# Altium project Fereydun_Board_Project.PrjPcb
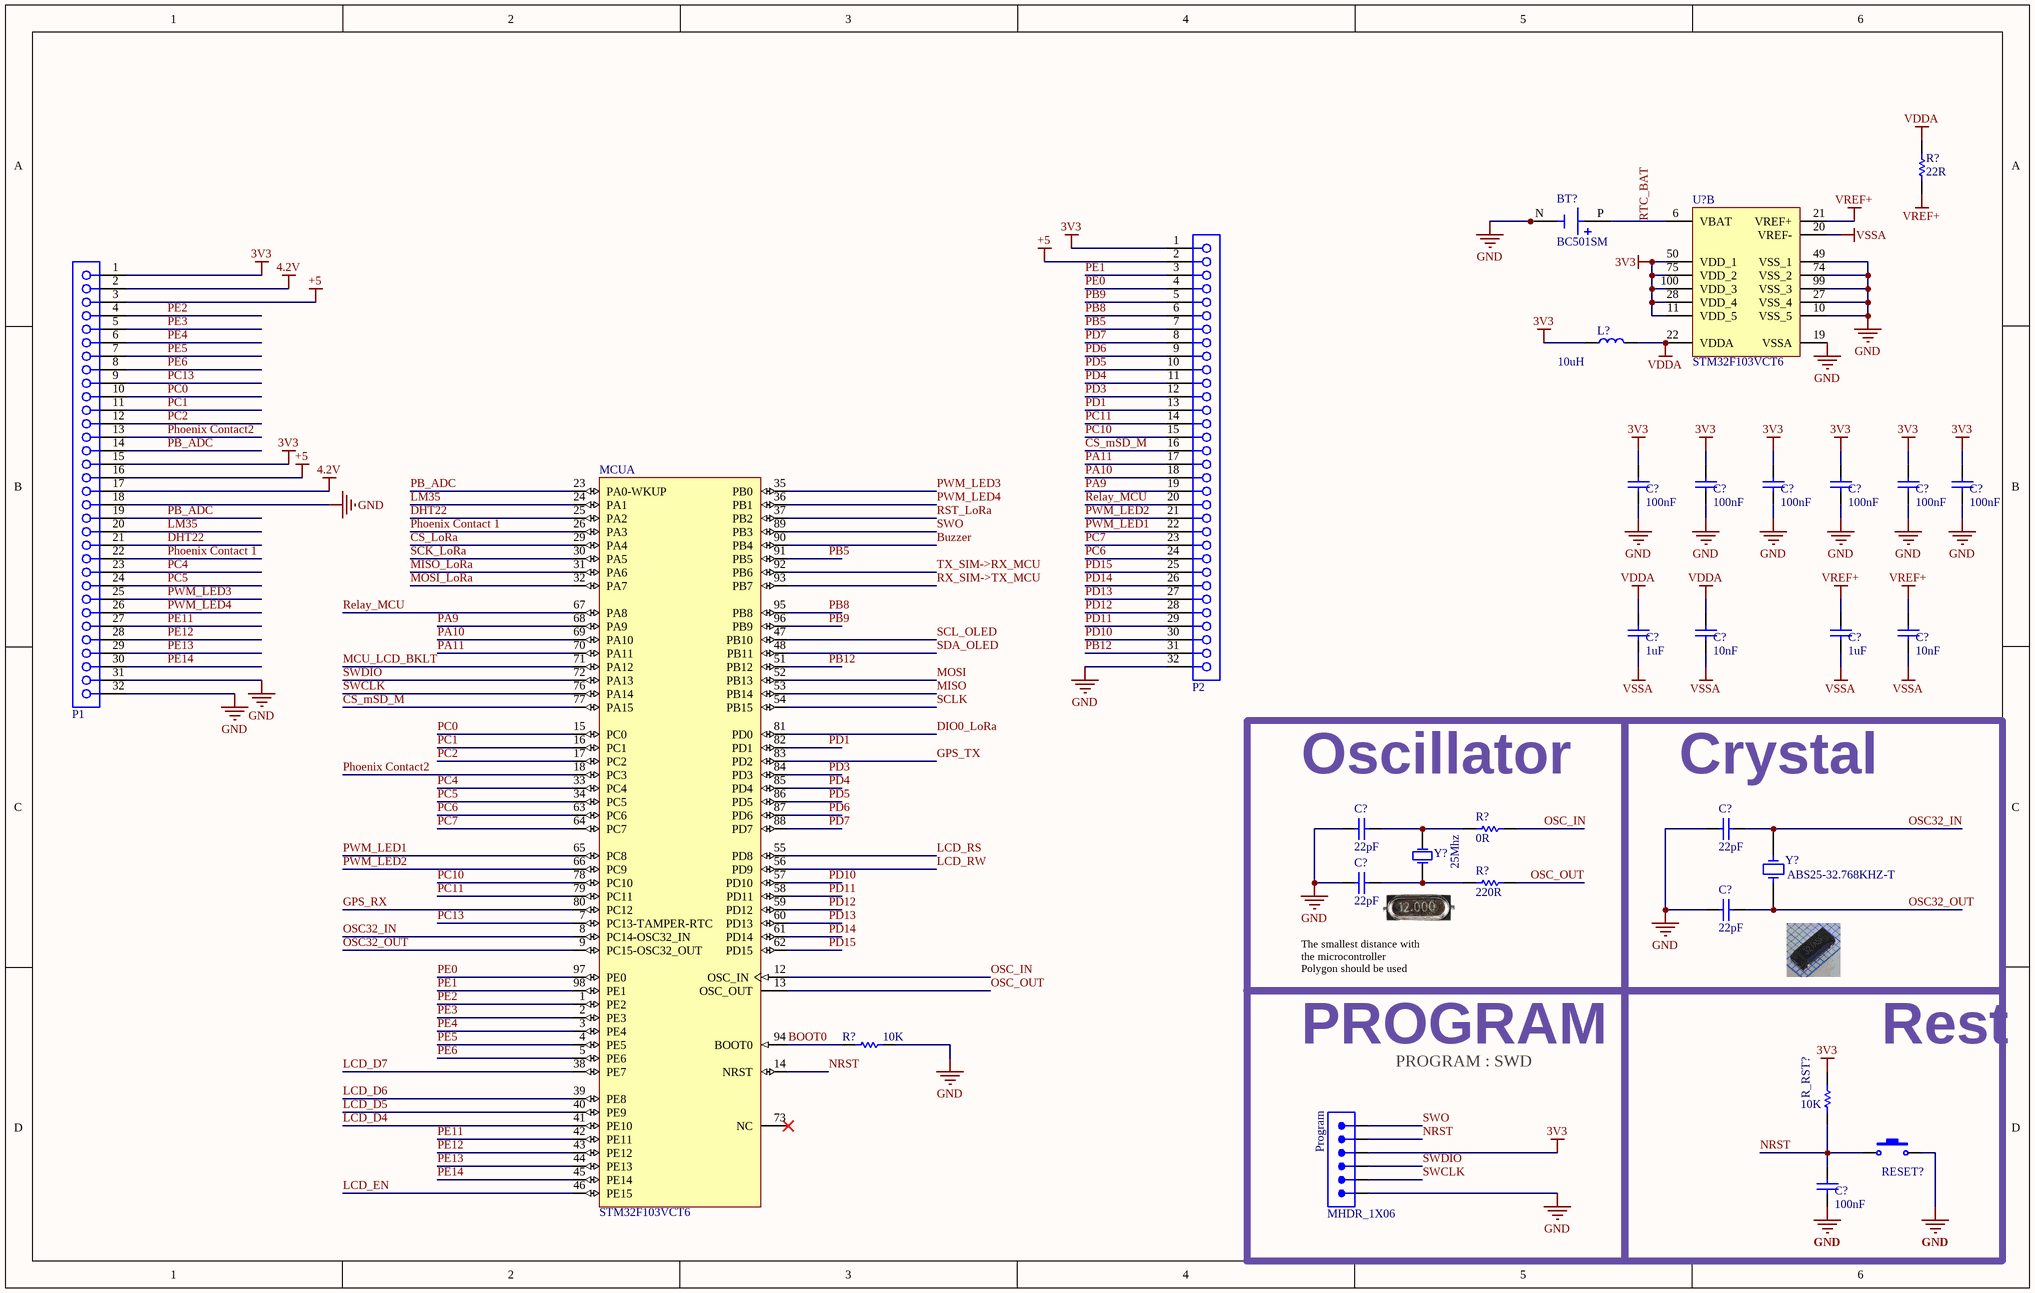
[diagram p0: MCU_F103VCT6.SchDoc]
6 sheets, 217 parts. Net scope: global (net labels, ports and power ports of the same name join across sheets).
Sheets:
  MCU_F103VCT6.SchDoc
  MCU_STM32F103C8T6.SchDoc
  POWER.SchDoc
  Communications.SchDoc
  UI.SchDoc
  ADC&Sensor&Relay.SchDoc

## Sheet MCU_F103VCT6.SchDoc
size 381 x 241 mm; SheetNumber: 1; SheetTotal: 6

### Parts
(Parts that share a designator on the sheet are numbered #1, #2 ... from top to bottom, then left to right.)
BT?  BC501SM  [BAT_BC501SM]
C?#1  100nF  [MY_CAP_SMD_0603]
C?#2  100nF  [MY_CAP_SMD_0603]
C?#3  100nF  [MY_CAP_SMD_0603]
C?#4  100nF  [MY_CAP_SMD_0603]
C?#5  100nF  [MY_CAP_SMD_0603]
C?#6  100nF  [MY_CAP_SMD_0603]
C?#7  1uF  [MY_CAP_SMD_0603]
C?#8  10nF  [MY_CAP_SMD_0603]
C?#9  1uF  [MY_CAP_SMD_0603]
C?#10  10nF  [MY_CAP_SMD_0603]
C?#11  22pF  [MY_CAP_SMD_0603]
C?#12  22pF  [MY_CAP_SMD_0603]
C?#13  22pF  [MY_CAP_SMD_0603]
C?#14  22pF  [MY_CAP_SMD_0603]
C?#15  100nF  [MY_CAP_SMD_0603]
L?#1  10uH  [L0603E]
MCU  STM32F103VCT6  [STM-LQFP100_N]  (part A of 2)
P1  61303211821  [61303211821]  (value not drawn)
P2  61303211821  [61303211821]  (value not drawn)
Program#1  MHDR_1X06  [MHDR1X06-254P]
R?#1  22R  [R0603]
R?#2  0R  [R0603]
R?#3  220R  [R0603]
R?#4  10K  [R0603]
R_RST?  10K  [RESC4817X04N]
RESET?#1  Switch PB  [Switch - Push to On]  (value not drawn)
U?#1  STM32F103VCT6  [STM-LQFP100_N]  (part B of 2)
Y?#1  25Mhz  [Crystal]
Y?#2  ABS25-32.768KHZ-T  [XTAL_ABS25-32.768KHZ-6-1-T]

### Blocks framed on the sheet
Oscillator: C?#11 C?#13 R?#2 R?#3 Y?#1
Crystal: C?#12 C?#14 Y?#2
PROGRAM: Program#1
Rest: C?#15 R_RST? RESET?#1

### Nets
3V3: C?#1.1 C?#2.1 C?#3.1 C?#4.1 C?#5.1 C?#6.1 L?#1.1 P1.1 P1.15 P2.1 Program#1.3 R_RST?.2 U?#1.11(VDD_5) U?#1.28(VDD_4) U?#1.50(VDD_1) U?#1.75(VDD_2) U?#1.100(VDD_3)
4.2V: P1.2 P1.17
+5: P1.3 P1.16 P2.2
GND: BT?.N(NEG) C?#1.2 C?#2.2 C?#3.2 C?#4.2 C?#5.2 C?#6.2 C?#11.1 C?#12.1 C?#13.1 C?#14.1 C?#15.2 P1.18 P1.31 P1.32 P2.32 Program#1.6 R?#4.1 RESET?#1.2 U?#1.10(VSS_5) U?#1.19(VSSA) U?#1.27(VSS_4) U?#1.49(VSS_1) U?#1.74(VSS_2) U?#1.99(VSS_3)
VDDA: C?#7.1 C?#8.1 L?#1.2 R?#1.1 U?#1.22(VDDA)
VREF+: C?#9.1 C?#10.1 R?#1.2 U?#1.21(VREF+)
VSSA: C?#7.2 C?#8.2 C?#9.2 C?#10.2 U?#1.20(VREF-)
BOOT0: MCU.94(BOOT0) R?#4.2
Buzzer: MCU.77(PA15) MCU.90(PB4) P2.16  [also labelled CS_mSD_M]
CS_LoRa: MCU.29(PA4)
DHT22: MCU.25(PA2) P1.21
DIO0_LoRa: MCU.81(PD0)
GPS_RX: MCU.80(PC12)
GPS_TX: MCU.83(PD2)
LCD_D4: MCU.41(PE10)
LCD_D5: MCU.40(PE9)
LCD_D6: MCU.39(PE8) MCU.47(PB10) MCU.95(PB8) P2.6  [also labelled PB8, SCL_OLED]
LCD_D7: MCU.38(PE7) MCU.48(PB11) MCU.96(PB9) P2.5  [also labelled PB9, SDA_OLED]
LCD_EN: MCU.46(PE15) MCU.53(PB14) MCU.56(PD9) MCU.91(PB5) P2.7  [also labelled LCD_RW, MISO, PB5]
LCD_RS: MCU.54(PB15) MCU.55(PD8)  [also labelled SCLK]
LM35: MCU.24(PA1) P1.20
MCU_LCD_BKLT: MCU.71(PA12)
MISO_LoRa: MCU.31(PA6)
MOSI: MCU.52(PB13)
MOSI_LoRa: MCU.32(PA7)
NRST: C?#15.1 MCU.14(NRST) Program#1.2 R_RST?.1 RESET?#1.1
OSC32_IN: C?#12.2 MCU.8(PC14-OSC32_IN) Y?#2.4
OSC32_OUT: C?#14.2 MCU.9(PC15-OSC32_OUT) Y?#2.1
OSC_IN: MCU.12(OSC_IN) R?#2.1
OSC_OUT: MCU.13(OSC_OUT) R?#3.1
PA9: MCU.68(PA9) MCU.93(PB7) P2.19  [also labelled RX_SIM->TX_MCU]
PA10: MCU.69(PA10) MCU.92(PB6) P2.18  [also labelled TX_SIM->RX_MCU]
PA11: MCU.70(PA11) P2.17
PB12: MCU.51(PB12) P2.31
PB_ADC: MCU.23(PA0-WKUP) P1.14 P1.19  [project net PA0]
PC0: MCU.15(PC0) P1.10
PC1: MCU.16(PC1) P1.11
PC2: MCU.17(PC2) P1.12
PC4: MCU.33(PC4) P1.23
PC5: MCU.34(PC5) P1.24
PC6: MCU.63(PC6) P2.24
PC7: MCU.64(PC7) P2.23
PC10: MCU.78(PC10) P2.15
PC11: MCU.79(PC11) P2.14
PC13: MCU.7(PC13-TAMPER-RTC) P1.9
PD1: MCU.82(PD1) P2.13
PD3: MCU.84(PD3) P2.12
PD4: MCU.85(PD4) P2.11
PD5: MCU.86(PD5) P2.10
PD6: MCU.87(PD6) P2.9
PD7: MCU.88(PD7) P2.8
PD10: MCU.57(PD10) P2.30
PD11: MCU.58(PD11) P2.29
PD12: MCU.59(PD12) P2.28
PD13: MCU.60(PD13) P2.27
PD14: MCU.61(PD14) P2.26
PD15: MCU.62(PD15) P2.25
PE0: MCU.97(PE0) P2.4
PE1: MCU.98(PE1) P2.3
PE2: MCU.1(PE2) P1.4
PE3: MCU.2(PE3) P1.5
PE4: MCU.3(PE4) P1.6
PE5: MCU.4(PE5) P1.7
PE6: MCU.5(PE6) P1.8
PE11: MCU.42(PE11) P1.27
PE12: MCU.43(PE12) P1.28
PE13: MCU.44(PE13) P1.29
PE14: MCU.45(PE14) P1.30
Phoenix Contact2: MCU.18(PC3) P1.13  [project net PA4]
Phoenix Contact 1: MCU.26(PA3) P1.22  [project net PA3]
PWM_LED1: MCU.65(PC8) P2.22  [project net PA6]
PWM_LED2: MCU.66(PC9) P2.21  [project net PA7]
PWM_LED3: MCU.35(PB0) MCU.67(PA8) P1.25 P2.20  [also labelled Relay_MCU]  [project net PB0]
PWM_LED4: MCU.36(PB1) P1.26
RST_LoRa: MCU.37(PB2)
RTC_BAT: BT?.P(POS) U?#1.6(VBAT)
SCK_LoRa: MCU.30(PA5)
SWCLK: MCU.76(PA14) Program#1.5
SWDIO: MCU.72(PA13) Program#1.4
SWO: MCU.89(PB3) Program#1.1
NetC?#11_2: C?#11.2 R?#2.2 Y?#1.2(OSC2)
NetC?#13_2: C?#13.2 R?#3.2 Y?#1.1(OSC1)

Not connected (* = marked no-connect by the designer): MCU 73(NC)*

### Notes on the sheet
- The smallest distance with the microcontroller
  Polygon should be used
- PROGRAM : SWD

### Library data of the parts
BT? = BC501SM: BATTERY HOLDER COIN 12MM SMD; MF: MPD; SnapEDA_Link: https://www.snapeda.com/parts/BC501SM/MPD/view-part/?ref=snap; Package: None; MP: BC501SM; Price: None; Availability: Unavailable; Check_prices: https://www.snapeda.com/parts/BC501SM/MPD/view-part/?ref=eda; Value: *
C?#1-C?#15 = CAP SMD_0603: 1.6 mm × 0.8 mm
L?#1 = Inductor SMD NC 0603: DatasheetVersion: 2021; ComponentLink1Description: Website Smart World; ComponentLink1URL: https://www.smartw.ir/; ComponentLink2Description: Telegram; ComponentLink2URL: https://t.me/altium_smartw; ComponentLink3Description: Instagram; ComponentLink3URL: https://Instagram.com/smartgw.ir
MCU U?#1 = STM32F103VCT6: ARM Cortex-M3 32-bit MCU, 256 KB Flash, 48 KB Internal RAM, 80 I/Os, 100-pin LQFP, -40 to 85 degC, Tray; ComponentLink1Description: Website Smart World; ComponentLink1URL: https://www.smartw.ir/
P1 P2 = 61303211821: WR-PHD Socket Header, THT, Vertical, pitch 2.54mm, 1 Row, 32P; Manufacturer: Wurth Elektronik; Contact Resistance: 20mOhm; Rated Current: 3A; Working Voltage: 250V; Withstanding Voltage: 500V; Manufacturer Part Number: 61303211821; Category: Board-to-Board Connectors; Match Code: WR-PHD; ComponentLink1Description: Website Link; ComponentLink1URL: https://www.we-online.com/redexpert/article/61303211821?ad; ComponentLink2Description: Datasheet Link; ComponentLink2URL: https://www.we-online.com/redexpert/spec/61303211821?ad; Mount: Through Hole; Operating Temperature Max: 105°C; Operating Temperature Min: -40°C; Packaging: Tray; Gender: Socket Header; Number of Pins: 32; Number of Rows: 1; Orientation: Vertical; Pitch: 2.54mm
Program#1 = MHDR_1X06: Male Header 1X06
R?#1-R?#4 = Resistor SMD 0603: Value: 1K; DatasheetVersion: 2021; ComponentLink1Description: Website Smart World; ComponentLink1URL: https://www.smartw.ir/; ComponentLink2Description: Telegram; ComponentLink2URL: https://t.me/altium_smartw; ComponentLink3Description: Instagram; ComponentLink3URL: https://Instagram.com/smartgw.ir
R_RST? = RES 1206 0.25W: RES 1206; Designer: Abbas Basereh; Desc.: RES SMD 1206; Data: 16-12-2016
RESET?#1 = Switch PB: Push Button Switch
Y?#1 = XTAL: Crystal Oscillator; Published: 8-Jun-2000; LatestRevisionDate: 17-Jul-2002; LatestRevisionNote: Re-released for DXP Platform.; PackageReference: R38; Publisher: Altium Limited
Y?#2 = ABS25-32.768KHZ-T: 32.768kHz Â±20ppm Crystal 12.5pF 50 kOhms 4-SOJ, 5.50mm pitch; MF: Abracon LLC; Package: 4-4 Abracon LLC; MP: ABS25-32.768KHZ; Value: *; Availability: Unavailable; Price: None; SnapEDA_Link: https://www.snapeda.com/parts/ABS25-32.768KHZ/Abracon%20LLC/view-part/478888/?ref=snap

## Sheet MCU_STM32F103C8T6.SchDoc
size 381 x 241 mm; SheetNumber: 2; SheetTotal: 6
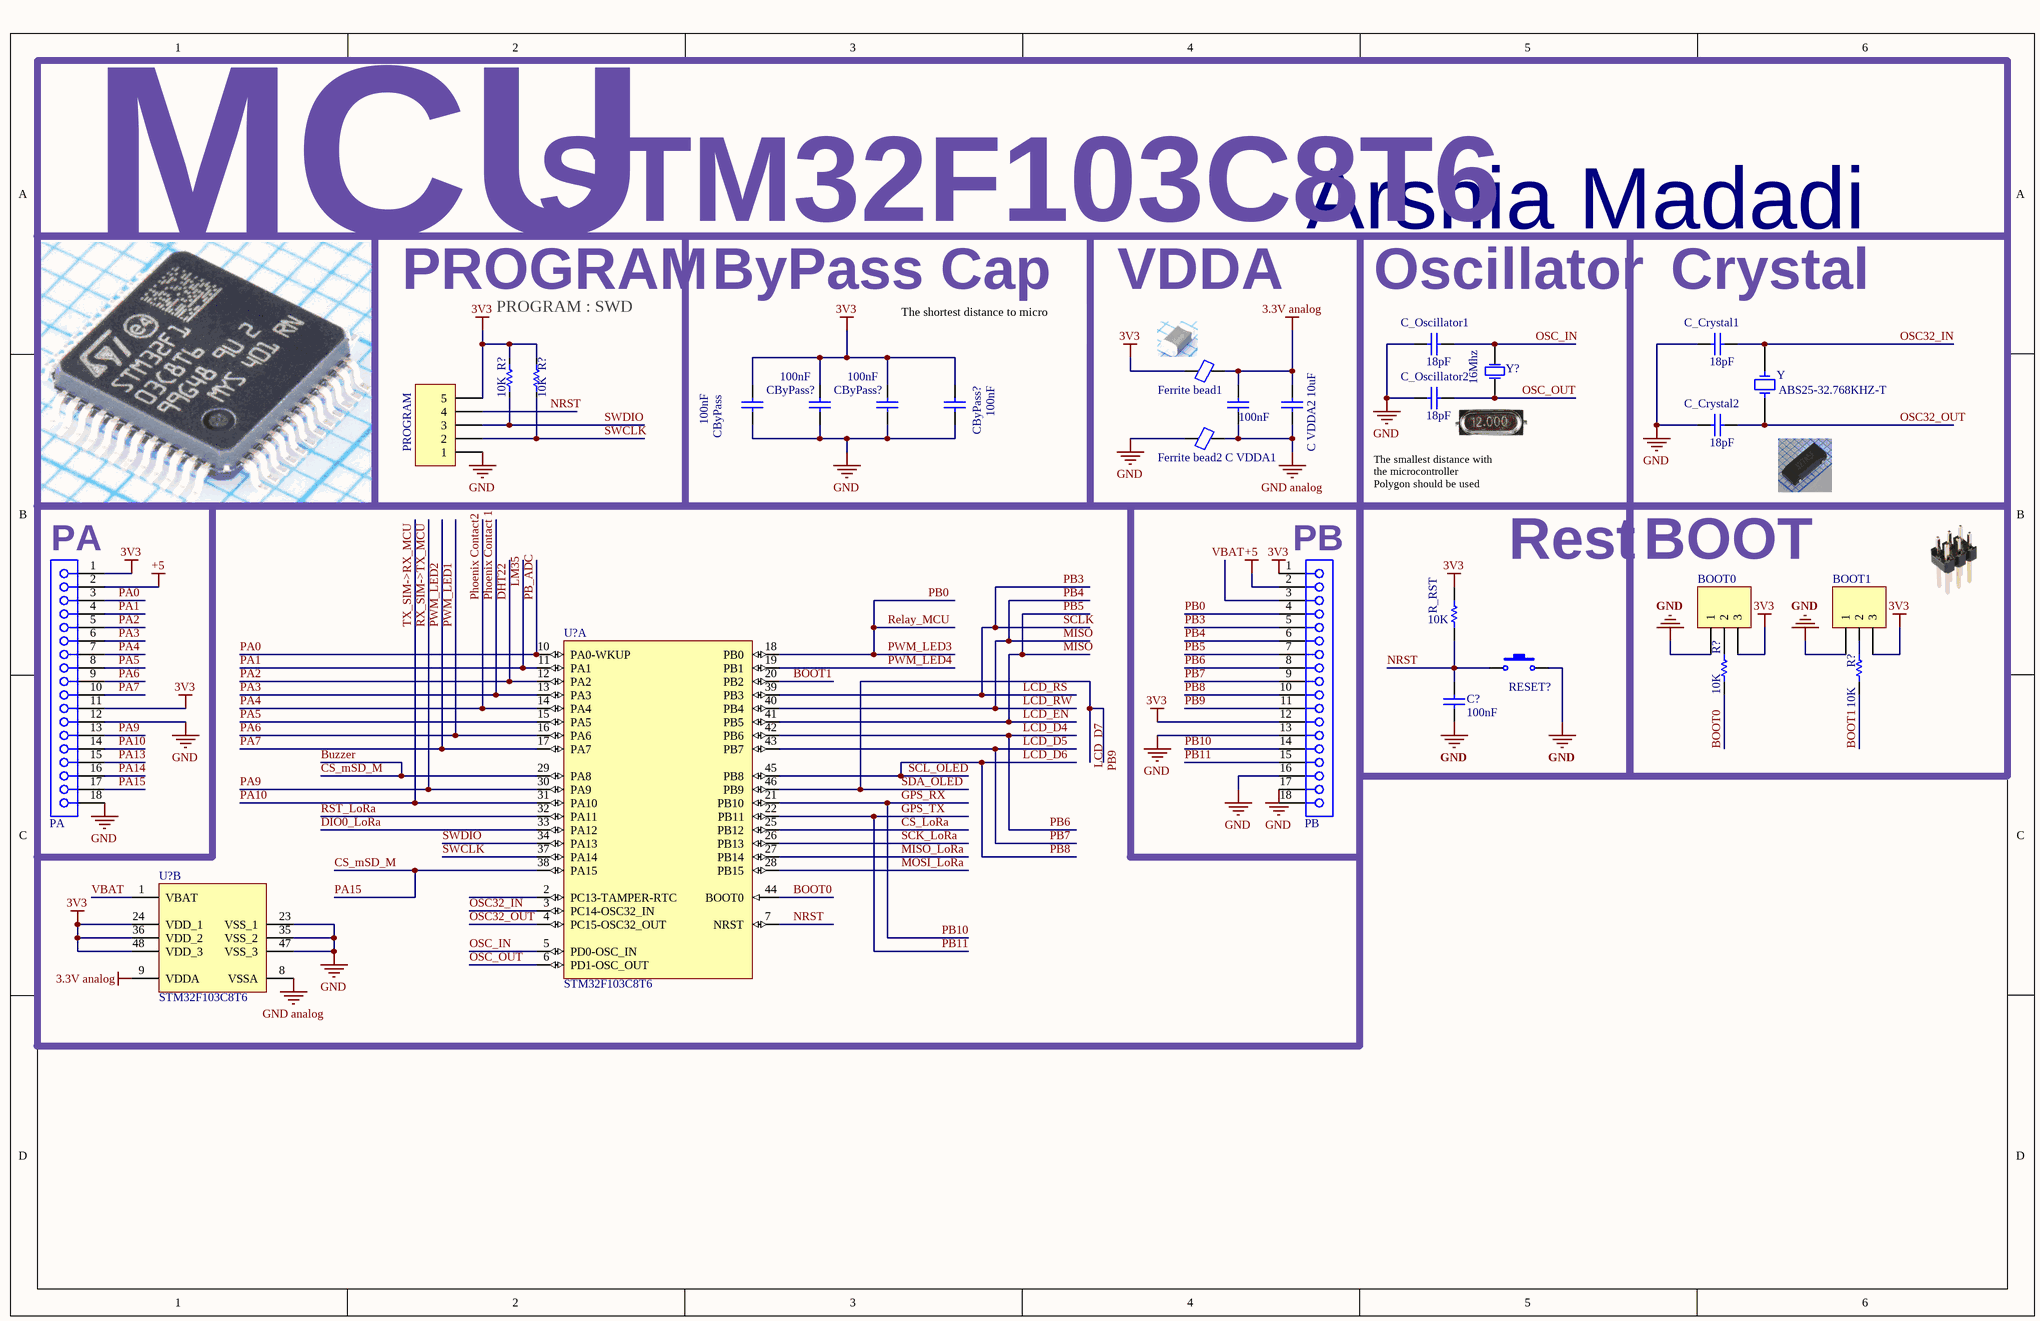
[diagram p1: MCU_STM32F103C8T6.SchDoc]

### Parts
(Parts that share a designator on the sheet are numbered #1, #2 ... from top to bottom, then left to right.)
BOOT0  Header 3  [My_1X03]  (value not drawn)
BOOT1  Header 3  [My_1X03]  (value not drawn)
C?#16  100nF  [CAPC4817X12N]
C_Crystal1  18pF  [CAPC4817X12N]
C_Crystal2  18pF  [CAPC4817X12N]
C_Oscillator1  18pF  [CAPC4817X12N]
C_Oscillator2  18pF  [CAPC4817X12N]
C_VDDA1  100nF  [CAPC4817X12N]
C_VDDA2  10uF  [CAPC4817X12N]
CByPass  100nF  [CAPC4817X12N]
CByPass?#1  100nF  [CAPC4817X12N]
CByPass?#2  100nF  [CAPC4817X12N]
CByPass?#3  100nF  [CAPC4817X12N]
Ferrite_bead1  Ferrite Bead SMD  [FB1206]  (value not drawn)
Ferrite_bead2  Ferrite Bead SMD  [FB1206]  (value not drawn)
PA  61301811821  [61301811821]  (value not drawn)
PB  61301811821  [61301811821]  (value not drawn)
PROGRAM#2  Header 5  [My_1X05]  (value not drawn)
R?#5  10K  [1206_Res]
R?#6  10K  [1206_Res]
R?#7  10K  [RESC4817X04N]
R?#8  10K  [RESC4817X04N]
R_RST  10K  [RESC4817X04N]
RESET?#2  Switch PB  [Switch - Push to On]  (value not drawn)
U?#2  STM32F103C8T6  [STM-LQFP48_M]  (part A of 2)
U?#3  STM32F103C8T6  [STM-LQFP48_M]  (part B of 2)
Y  ABS25-32.768KHZ-T  [XTAL_ABS25-32.768KHZ-6-1-T]
Y?#3  16Mhz  [Crystal]

### Blocks framed on the sheet
MCU: C_Crystal1 C_Crystal2 C_Oscillator1 C_Oscillator2 C_VDDA1 C_VDDA2 CByPass CByPass?#1-CByPass?#3 Ferrite_bead1 Ferrite_bead2 PROGRAM#2 R?#5 R?#6 Y Y?#3
PA: PA
PB: PB
Rest: C?#16 R_RST RESET?#2
BOOT: BOOT0 BOOT1 R?#7 R?#8

### Nets
3.3V analog: C_VDDA1.2 C_VDDA2.2 Ferrite_bead1.2 U?#3.9(VDDA)
3V3: BOOT0.3 BOOT1.3 CByPass.2 CByPass?#1.2 CByPass?#2.2 CByPass?#3.2 Ferrite_bead1.1 PA.1 PA.11 PB.1 PB.12 PROGRAM#2.5 R?#5.2 R?#6.2 R_RST.2 U?#3.24(VDD_1) U?#3.36(VDD_2) U?#3.48(VDD_3)
+5: PA.2 PB.2
GND: BOOT0.1 BOOT1.1 C?#16.1 C_Crystal1.1 C_Crystal2.1 C_Oscillator1.1 C_Oscillator2.1 CByPass.1 CByPass?#1.1 CByPass?#2.1 CByPass?#3.1 Ferrite_bead2.1 PA.12 PA.18 PB.13 PB.16 PB.17 PROGRAM#2.1 RESET?#2.2 U?#3.23(VSS_1) U?#3.35(VSS_2) U?#3.47(VSS_3)
GND analog: C_VDDA1.1 C_VDDA2.1 Ferrite_bead2.2 U?#3.8(VSSA)
BOOT0: R?#7.1 U?#2.44(BOOT0)
BOOT1: R?#8.1 U?#2.20(PB2)
Buzzer: PA.17 U?#2.29(PA8) U?#2.38(PA15)  [also labelled CS_mSD_M, PA15]
CS_LoRa: U?#2.25(PB12)
DHT22: PA.5 U?#2.12(PA2)  [also labelled PA2]
DIO0_LoRa: U?#2.33(PA12)
GPS_RX: PB.14 U?#2.21(PB10)  [also labelled PB10]
GPS_TX: PB.15 U?#2.22(PB11)  [also labelled PB11]
LCD_D4: PB.8 U?#2.42(PB6)  [also labelled PB6]
LCD_D5: PB.9 U?#2.43(PB7)  [also labelled PB7]
LCD_D6: PB.10 U?#2.45(PB8)  [also labelled PB8, SCL_OLED]
LCD_D7: PB.11 U?#2.46(PB9)  [also labelled PB9, SDA_OLED]
LCD_EN: PB.6 PB.7 U?#2.40(PB4) U?#2.41(PB5)  [also labelled LCD_RW, MISO, PB4, PB5]
LCD_RS: PB.5 U?#2.39(PB3)  [also labelled PB3, SCLK]
LM35: PA.4 U?#2.11(PA1)  [also labelled PA1]
MISO_LoRa: U?#2.27(PB14)
MOSI_LoRa: U?#2.28(PB15)
NRST: C?#16.2 PROGRAM#2.4 R_RST.1 RESET?#2.1 U?#2.7(NRST)
OSC32_IN: C_Crystal1.2 U?#2.3(PC14-OSC32_IN) Y.4
OSC32_OUT: C_Crystal2.2 U?#2.4(PC15-OSC32_OUT) Y.1
OSC_IN: C_Oscillator1.2 U?#2.5(PD0-OSC_IN) Y?#3.2(OSC2)
OSC_OUT: C_Oscillator2.2 U?#2.6(PD1-OSC_OUT) Y?#3.1(OSC1)
PA0: PA.3 U?#2.10(PA0-WKUP)  [also labelled PB_ADC]
PA3: PA.6 U?#2.13(PA3)  [also labelled Phoenix Contact 1]
PA4: PA.7 U?#2.14(PA4)  [also labelled Phoenix Contact2]
PA5: PA.8 U?#2.15(PA5)
PA6: PA.9 U?#2.16(PA6)  [also labelled PWM_LED1]
PA7: PA.10 U?#2.17(PA7)  [also labelled PWM_LED2]
PA9: PA.13 U?#2.30(PA9)  [also labelled RX_SIM->TX_MCU]
PA10: PA.14 U?#2.31(PA10)  [also labelled TX_SIM->RX_MCU]
PA13: PA.15
PA14: PA.16
PB0: PB.4 U?#2.18(PB0)  [also labelled PWM_LED3, Relay_MCU]
PWM_LED4: U?#2.19(PB1)
RST_LoRa: U?#2.32(PA11)
SCK_LoRa: U?#2.26(PB13)
SWCLK: PROGRAM#2.2 R?#6.1 U?#2.37(PA14)
SWDIO: PROGRAM#2.3 R?#5.1 U?#2.34(PA13)
VBAT: U?#3.1(VBAT)
NetBOOT1_2: BOOT1.2 R?#8.2

Not connected (* = marked no-connect by the designer): BOOT0 2; PB 3 18; R?#7 2; U?#2 2(PC13-TAMPER-RTC)

### Notes on the sheet
- STM32F103C8T6
- Arshia Madadi
- PROGRAM
- (near R?#5) PROGRAM : SWD
- ByPass Cap
- VDDA
- Oscillator
- (near C_Crystal1) Crystal
- The shortest distance to micro
- The smallest distance with the microcontroller
  Polygon should be used
- Labels drawn without touching a wire or pin: VBAT

### Library data of the parts
BOOT0 BOOT1 = Header 3: Header, 3-Pin; LatestRevisionDate: 17-Jul-2002; LatestRevisionNote: Re-released for DXP Platform.; Publisher: Altium Limited
C?#16 C_Crystal1 C_Crystal2 C_Oscillator1 C_Oscillator2 C_VDDA1 C_VDDA2 CByPass CByPass?#1-CByPass?#3 = CAP SMD 1206: CAP 1206; Designer: Abbas Basereh; Desc.: CAP SMD 1206; Data: 16-12-2016
Ferrite_bead1 Ferrite_bead2 = Ferrite Bead SMD Package: Designer: Ali Hafizi
PA PB = 61301811821: WR-PHD Socket Header, THT, Vertical, pitch 2.54mm, 1 Row, 18P; Manufacturer: Wurth Elektronik; Contact Resistance: 20mOhm; Rated Current: 3A; Working Voltage: 250V; Withstanding Voltage: 500V; Manufacturer Part Number: 61301811821; Category: Board-to-Board Connectors; Match Code: WR-PHD; ComponentLink1Description: Website Link; ComponentLink1URL: https://www.we-online.com/redexpert/article/61301811821?ad; ComponentLink2Description: Datasheet Link; ComponentLink2URL: https://www.we-online.com/redexpert/spec/61301811821?ad; Mount: Through Hole; Operating Temperature Max: 105°C; Operating Temperature Min: -40°C; Packaging: Tray; Gender: Socket Header; Number of Pins: 18; Number of Rows: 1; Orientation: Vertical; Pitch: 2.54mm
PROGRAM#2 = Header 5: Header, 5-Pin; LatestRevisionDate: 17-Jul-2002; LatestRevisionNote: Re-released for DXP Platform.; Publisher: Altium Limited
R?#5 R?#6 = Res: Resistor; Published: 8-Jun-2000; LatestRevisionDate: 17-Jul-2002; LatestRevisionNote: Re-released for DXP Platform.; PackageReference: AXIAL-0.3; Publisher: Altium Limited
R?#7 R?#8 R_RST = RES 1206 0.25W: as R_RST? on sheet MCU_F103VCT6; Data: 16-12-2016
RESET?#2 = Switch PB: Push Button Switch
U?#2 U?#3 = STM32F103C8T6: ARM Cortex-M3 32-bit MCU, 64 KB Flash, 20 KB Internal RAM, 37 I/Os, 48-pin LQFP, -40 to 85 degC, Tray; A/D Converter: 2x12-bit (10 Channel); FLASH Size (Prog) (kB): 64; I/Os (High Current): 37; Internal RAM Size (kB): 20; Operating Frequency(F) (Processor speed) (MHz): 72; Supply Voltage(Vcc) min (V): 2; DatasheetVersion: Rev. 16; PackageVersion: Rev. 6, 06/2013; PackageReference: LQFP48; PackageDescription: 48-Pin Low Profile Quad Flat Package, 7 x 7 mm Body, 0.5 mm Pitch; Supplier 1: Digi-Key; Supplier Part Number 1: 497-6063-ND; Supplier 2: Farnell; Supplier Part Number 2: 1447637; Supplier 3: Newark; Supplier Part Number 3: 59M2182; Supplier 4: Newark; Supplier Part Number 4: 57P1222; Supplier 5: Mouser; Supplier Part Number 5: 511-STM32F103C8T6; Core: ARM Cortex-M3; Packing: Tray; Mounting Technology: Surface Mount; PartNumber: STM32F103C8T6; ComponentLink1Description: Manufacturer URL; ComponentLink1URL: http://www.st.com/web/en/home.html; ComponentLink2Description: Datasheet; ComponentLink2URL: http://www.st.com/st-web-ui/static/active/en/resource/technical/document/datasheet/CD00161566.pdf; ComponentLink3Description: Package Specification; ComponentLink3URL: http://www.st.com/st-web-ui/static/active/en/resource/technical/document/datasheet/DM00058181.pdf
Y = ABS25-32.768KHZ-T: as Y?#2 on sheet MCU_F103VCT6; Package: 4-4 Abracon LLC; MP: ABS25-32.768KHZ; Value: *; Availability: Unavailable; Price: None; SnapEDA_Link: https://www.snapeda.com/parts/ABS25-32.768KHZ/Abracon%20LLC/view-part/478888/?ref=snap
Y?#3 = XTAL: Crystal Oscillator; Published: 8-Jun-2000; LatestRevisionDate: 17-Jul-2002; LatestRevisionNote: Re-released for DXP Platform.; PackageReference: R38; Publisher: Altium Limited

## Sheet POWER.SchDoc
size A; SheetNumber: 1; SheetTotal: 3
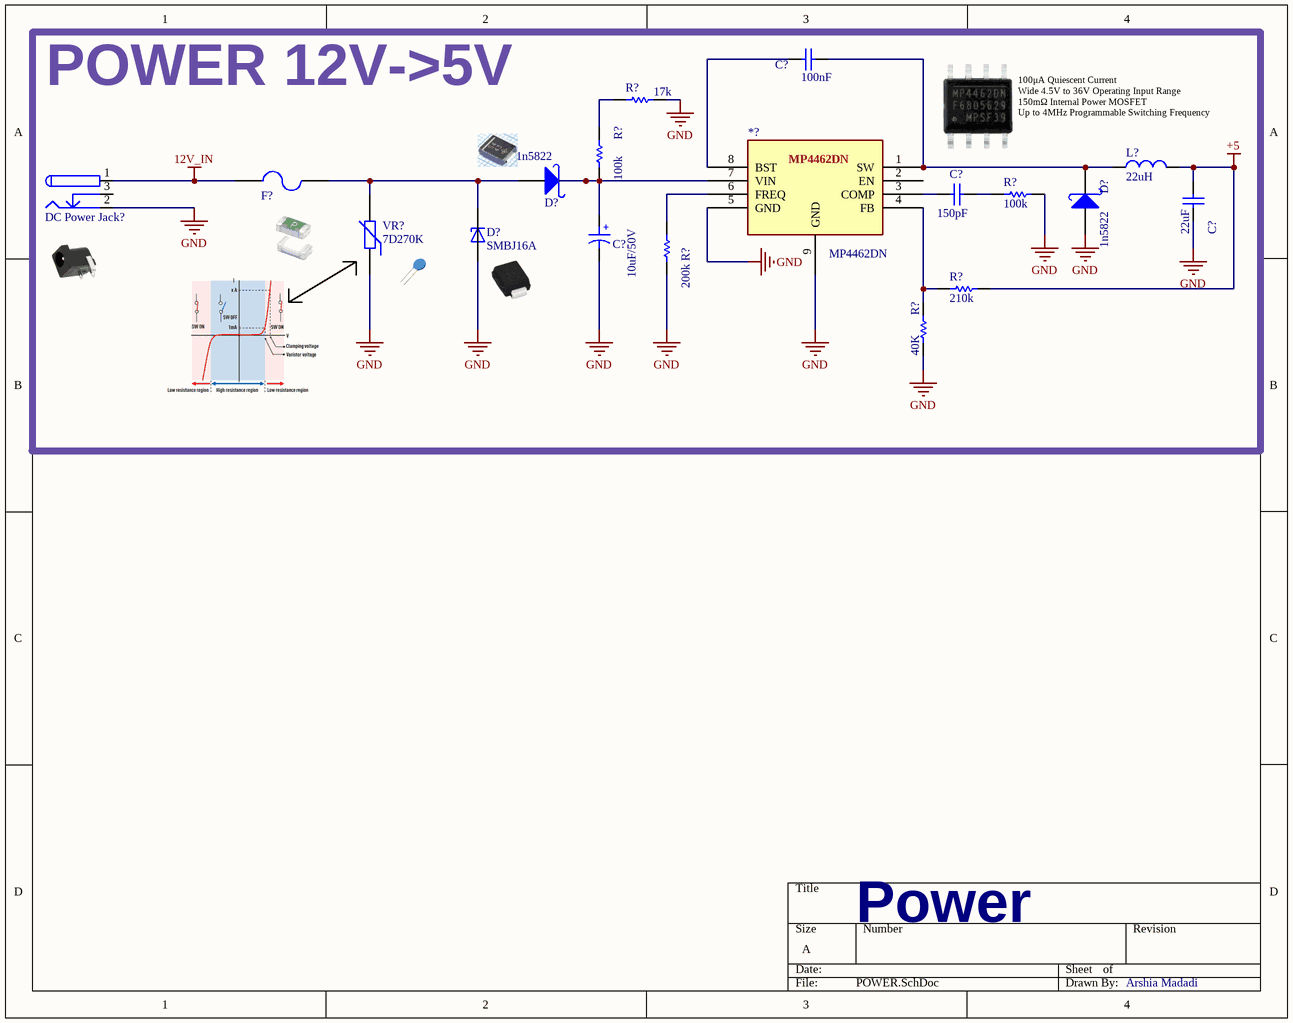
[diagram p2: POWER.SchDoc]

### Parts
(Parts that share a designator on the sheet are numbered #1, #2 ... from top to bottom, then left to right.)
*?  MP4462DN  [PCBComponent_1 - duplicate]
C?#17  100nF  [CAP1206]
C?#18  150pF  [CAP1206]
C?#19  22uF  [CAP1206]
C?#20  Part. No: 10uF/50V  [Cap electrolitic radial 10x20-5]  (hidden comment: Cap 10x21)
D?#1  1n5822  [DO-214AB(SMC)]
D?#2  1n5822  [DO-214AB(SMC)]
D?#3  SMBJ16A  [DIOM4336X265N]
DC_Power_Jack?  DC Power Jack  [DC Power Jack 1]  (value not drawn)
F?  F=3.0 A  [1206 FUSE]  (value not drawn)
L?#2  value 22uH  [0805 - big]  (hidden comment: 10uH)
R?#9  17k  [RESC4817X04N]
R?#10  100k  [RESC4817X04N]
R?#11  100k  [RESC4817X04N]
R?#12  200k  [RESC4817X04N]
R?#13  210k  [RESC4817X04N]
R?#14  40K  [RESC4817X04N]
VR?  7D270K  [07D XXX]

### Blocks framed on the sheet
POWER 12V->5V: *? C?#17-C?#20 D?#1-D?#3 DC_Power_Jack? F? L?#2 R?#9-R?#14 VR?

### Nets
12V_IN: DC_Power_Jack?.1 F?.1
+5: C?#19.1 L?#2.2 R?#13.2
GND: *?.5(GND) *?.9(GND) C?#19.2 C?#20.2 D?#2.1(A) D?#3.A DC_Power_Jack?.2 R?#9.2 R?#11.2 R?#12.1 R?#14.1 VR?.1
Net*?_1: *?.1(SW) C?#17.1 D?#2.2(K) L?#2.1
Net*?_3: *?.3(COMP) C?#18.2
Net*?_4: *?.4(FB) R?#13.1 R?#14.2
Net*?_6: *?.6(FREQ) R?#12.2
Net*?_7: *?.7(VIN) C?#20.1 D?#1.2(K) R?#10.2
Net*?_8: *?.8(BST) C?#17.2
NetC?#18_1: C?#18.1 R?#11.1
NetD?#1_1: D?#1.1(A) D?#3.C F?.2 VR?.2
NetR?#9_1: R?#9.1 R?#10.1

Not connected (* = marked no-connect by the designer): *? 2(EN); DC_Power_Jack? 3

### Notes on the sheet
- (near L?#2) 100μA Quiescent Current
  Wide 4.5V to 36V Operating Input Range
  150mΩ Internal Power MOSFET
  Up to 4MHz Programmable Switching Frequency
- Power
- Arshia Madadi
- (in symbol Cap electrolitic radial 10x21) +

### Library data of the parts
C?#17 = CAP SMD PACKAGE: TOTAL CAPACITOR SMD PACK; Designer: Abbas Basereh; Desc.: CAP SMD TOTAL PACKAGES; Data: 2017-3-10; VALUE: 100nF
C?#18 C?#19 = CAP SMD PACKAGE: TOTAL CAPACITOR SMD PACK; Designer: Abbas Basereh; Desc.: CAP SMD TOTAL PACKAGES; VALUE: 100nF; Data: 2017-3-10
C?#20 = Cap electrolitic radial 10x21: Cap electrolitic radial; Designer: Abbas Basereh; Data: 16-12-2016
D?#1 D?#2 = 1N5822 SMD: Schottky Rectifiers; Part. No: SS34; Manufacturer: ON Semiconductor/Fairchild; Designer: Abbas Basereh; Link: https://www.aliexpress.com/item/Free-shipping-100pcs-1n5822-sma-smd-do-214ac-Schottky-diode-ss34/32337482329.html?spm=2114.01010208.3.1.zLZDsP&ws_ab_test=searchweb0_0,searchweb201602_4_10065_10068_10084_10083_10080_10082_10081_10060_10061_10062_10056_10055_10054_10059_10099_10078_10079_427_10073_10103_10102_10096_10052_10050_10051,searchweb201603_4&btsid=6e50dc92-ac69-45bc-a19e-209af19ce602; Link: http://www.tme.eu/en/details/ss34/smd-schottky-diodes/vishay/ss34-e357t/; Link: http://www.digikey.com/product-detail/en/on-semiconductor-fairchild/SS34/SS34FSCT-ND/2094459; Data: 16-12-2016
D?#3 = SMBJ16A: 600W, 18.8V, 5%, Unidirectional, TVS; MF: Taiwan Semiconductor; MP: SMBJ16A; SnapEDA_Link: https://www.snapeda.com/parts/SMBJ16A/Taiwan+Semiconductor/view-part/?ref=snap; Check_prices: https://www.snapeda.com/parts/SMBJ16A/Taiwan+Semiconductor/view-part/?ref=eda; Price: None; Availability: In Stock; Purchase-URL: https://pricing.snapeda.com/search/part/SMBJ16A/?ref=eda; Package: SMD-2-2 Avago; Value: *
DC_Power_Jack? = DC Power Jack: DC Power Jack. Center Pin 2.5mm. Diameter: 5.7mm; Designer: Ali Hafizi; Company: Personal; Project Name: Laser; Adding Date: 10/21/2009
F? = Fuse SMD1206: SMD Fuses 1206; Designer: Abbas Basereh; Desc.: SMD Fuses 1206; Data: 16-12-2016
L?#2 = Inductor: Code_IEC: 1005; Published: 8-Jun-2000; LatestRevisionDate: 17-Jul-2002; LatestRevisionNote: Re-released for DXP Platform.; PackageReference: 0402-A; Publisher: Altium Limited; Code_JEITA: 0402
R?#9-R?#14 = RES 1206 0.25W: as R_RST? on sheet MCU_F103VCT6; Data: 16-12-2016
VR? = VARISTOR (VDR): VARISTORS; Manufacturer: china-canada-philipina; Designer: Abbas Basereh; VALUE: xxDxxx; Models: MOV-VDR-COV; Data: 2017-1-5; Link: digikey.com; PUBLISHER: ABBAS BASEREH

## Sheet Communications.SchDoc
size 381 x 241 mm; SheetNumber: 4; SheetTotal: 6
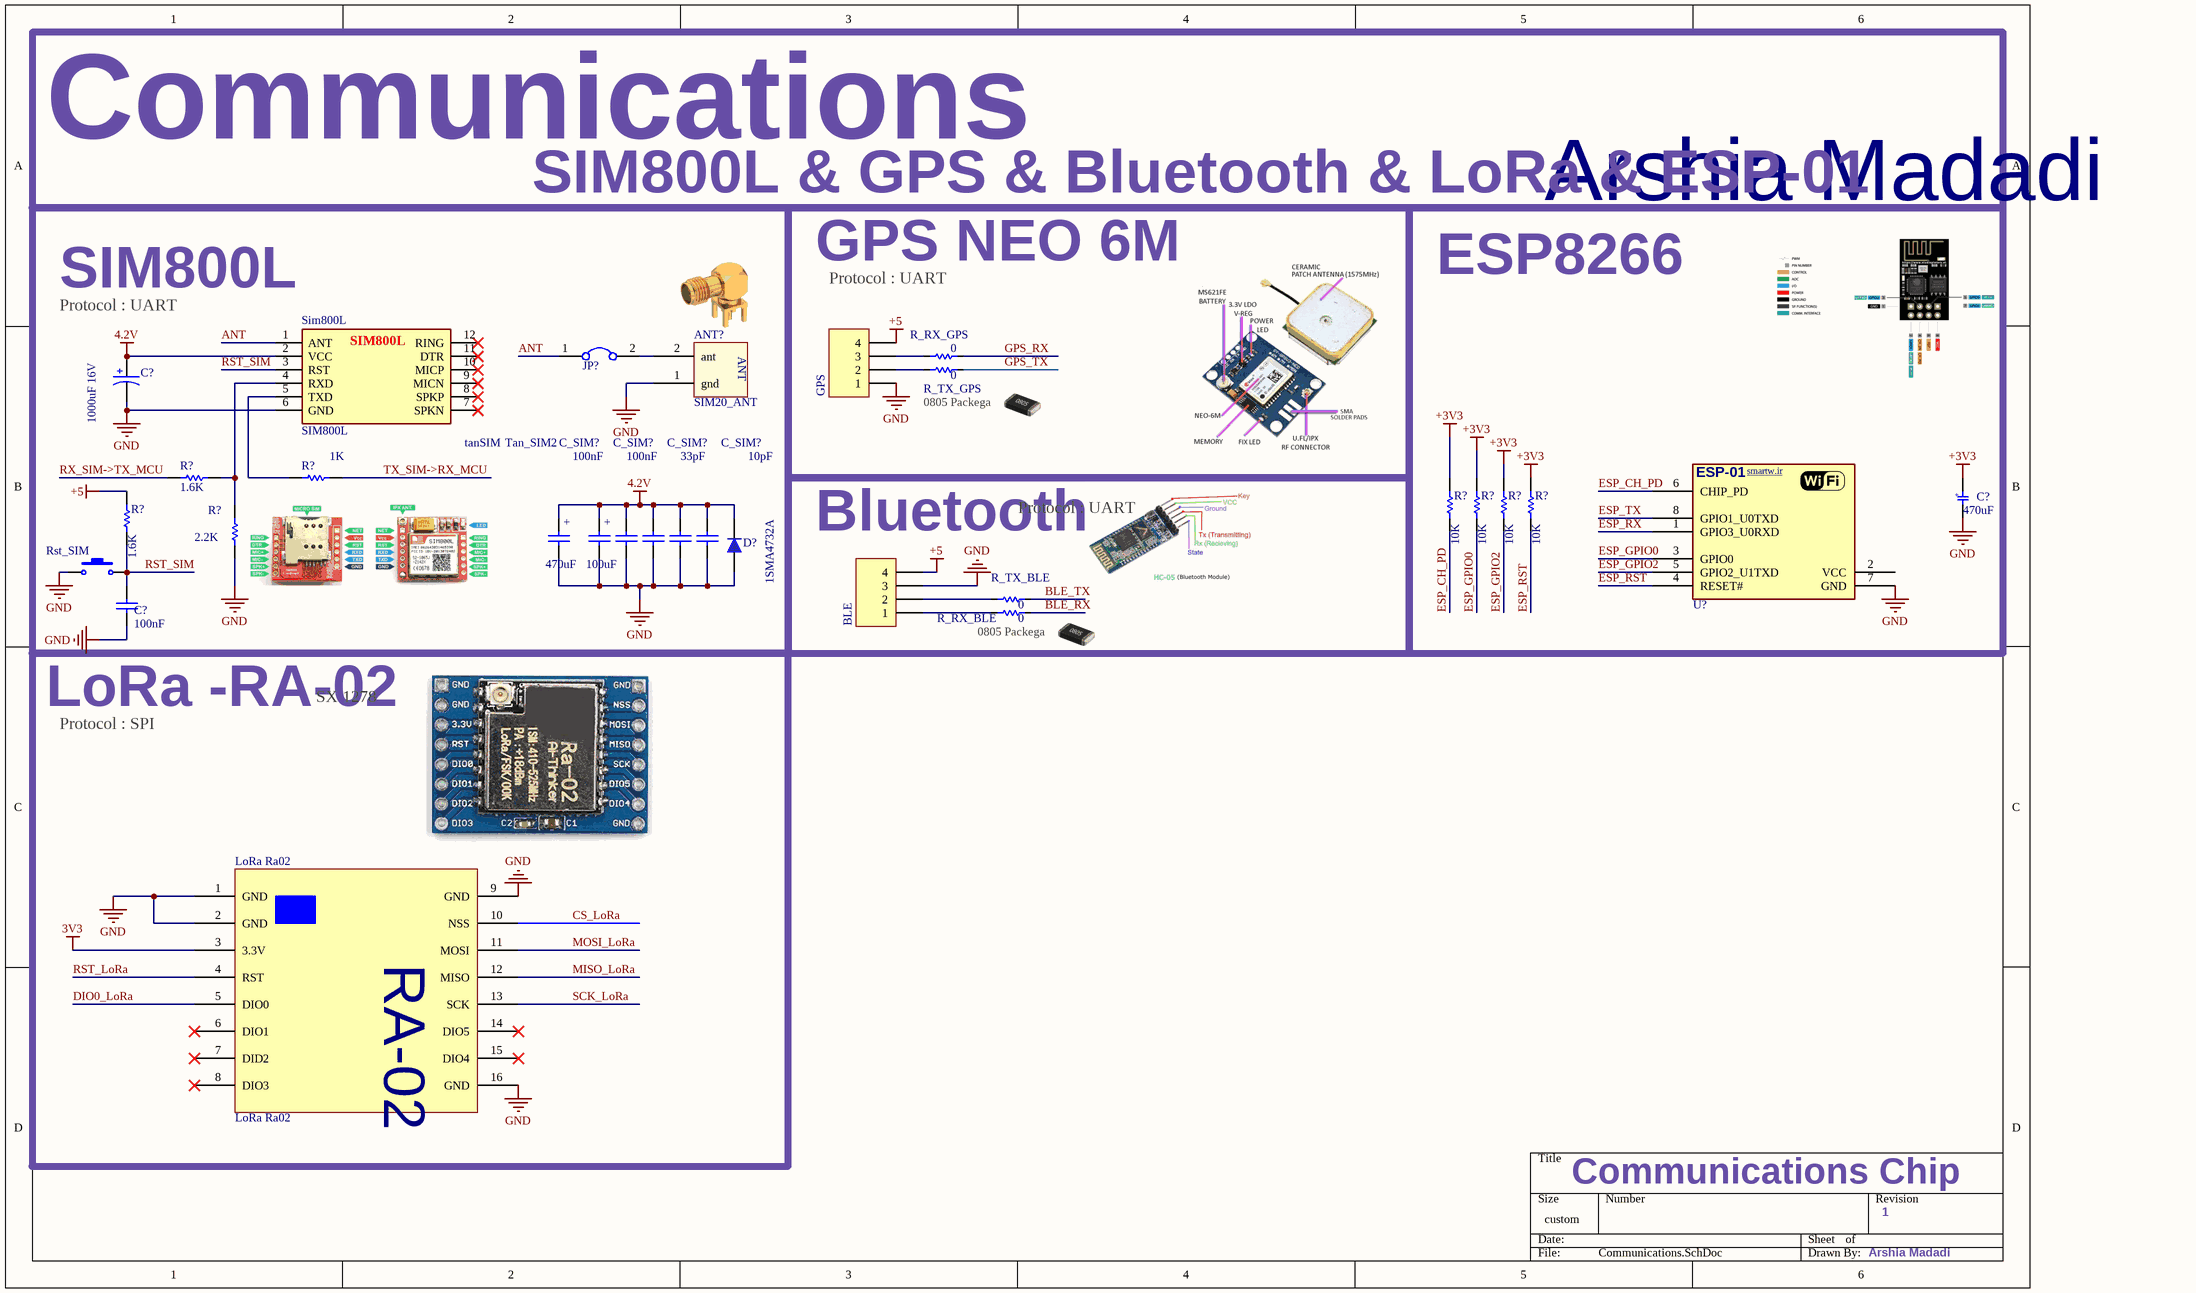
[diagram p3: Communications.SchDoc]

### Parts
(Parts that share a designator on the sheet are numbered #1, #2 ... from top to bottom, then left to right.)
100uF  Tan_SIM2  [MY_CAP_SMD-C]
470uF  tanSIM  [MY_CAP_SMD-C]
ANT?  SIM20_ANT  [MY_SIM20_ANT]
BLE  Header 4  [My_1X04]  (value not drawn)
C?#21  1000uF 16V  [SMD_1000uf 16V]
C?#22  470uF  [C_EL_10_10]
C?#23  100nF  [MY_CAP_SMD_0603]
C_SIM?#1  100nF  [CAP1206]
C_SIM?#2  100nF  [CAP1206]
C_SIM?#3  33pF  [CAP1206]
C_SIM?#4  10pF  [CAP1206]
D?#4  1SMA4732A  [SMA DIODE 2]
GPS  Header 4  [My_1X04]  (value not drawn)
JP?  Jumper  [Jumper Small - 2.54 - GRAY]  (value not drawn)
LoRa_Ra02  LoRa Ra02  [PCBComponent_1]
R?#15  1.6K  [RESC3413X04N]
R?#16  1K  [RESC3413X04N]
R?#17  10K  [RESC3413X04N]
R?#18  10K  [RESC3413X04N]
R?#19  10K  [RESC3413X04N]
R?#20  10K  [RESC3413X04N]
R?#21  1.6K  [RESC3413X04N]
R?#22  2.2K  [RESC3413X04N]
R_RX_BLE  0  [0805]
R_RX_GPS  0  [0805]
R_TX_BLE  0  [0805]
R_TX_GPS  0  [0805]
Rst_SIM  Switch PB  [SW-PB]  (value not drawn)
Sim800L  SIM800L  [SIM800L]
U?#4  ESP8266 ESP-01  [ESP8266_ESP01]  (value not drawn)

### Blocks framed on the sheet
SIM800L & GPS & Bluetooth & LoRa & ESP-01: 100uF 470uF ANT? C?#21 C?#23 C_SIM?#1-C_SIM?#4 D?#4 JP? R?#15 R?#16 R?#21 R?#22 Rst_SIM Sim800L
GPS NEO 6M: GPS R_RX_GPS R_TX_GPS
Arshia Madadi: C?#22 R?#17-R?#20 U?#4
Bluetooth: BLE R_RX_BLE R_TX_BLE
LoRa -RA-02: LoRa_Ra02

### Nets
3V3: LoRa_Ra02.3(3.3V)
4.2V: 100uF.+ 470uF.+ C?#21.1 C_SIM?#1.1 C_SIM?#2.1 C_SIM?#3.1 C_SIM?#4.1 D?#4.2 Sim800L.2(VCC)
+3V3: C?#22.2 R?#17.2 R?#18.2 R?#19.2 R?#20.2
+5: BLE.4 GPS.4 R?#21.2
GND: 100uF.- 470uF.- ANT?.1(gnd) BLE.3 C?#21.2 C?#22.1 C?#23.2 C_SIM?#1.2 C_SIM?#2.2 C_SIM?#3.2 C_SIM?#4.2 D?#4.1 GPS.1 LoRa_Ra02.1(GND) LoRa_Ra02.2(GND) LoRa_Ra02.9(GND) LoRa_Ra02.16(GND) R?#22.2 Rst_SIM.1 Sim800L.6(GND) U?#4.7(GND)
ANT: JP?.1 Sim800L.1(ANT)
BLE_RX: R_RX_BLE.2
BLE_TX: R_TX_BLE.2
CS_LoRa: LoRa_Ra02.10(NSS)
DIO0_LoRa: LoRa_Ra02.5(DIO0)
ESP_CH_PD: R?#17.1 U?#4.6(CHIP_PD)
ESP_GPIO0: R?#18.1 U?#4.3(GPIO0)
ESP_GPIO2: R?#19.1 U?#4.5(GPIO2_U1TXD)
ESP_RST: R?#20.1 U?#4.4(RESET#)
ESP_RX: U?#4.1(GPIO3_U0RXD)
ESP_TX: U?#4.8(GPIO1_U0TXD)
GPS_RX: R_RX_GPS.2
GPS_TX: R_TX_GPS.2
MISO_LoRa: LoRa_Ra02.12(MISO)
MOSI_LoRa: LoRa_Ra02.11(MOSI)
RST_LoRa: LoRa_Ra02.4(RST)
RST_SIM: C?#23.1 R?#21.1 Rst_SIM.2 Sim800L.3(RST)
RX_SIM->TX_MCU: R?#15.2  [project net PA9]
SCK_LoRa: LoRa_Ra02.13(SCK)
TX_SIM->RX_MCU: R?#16.1  [project net PA10]
NetANT?_2: ANT?.2(ant) JP?.2
NetBLE_1: BLE.1 R_RX_BLE.1
NetBLE_2: BLE.2 R_TX_BLE.1
NetGPS_2: GPS.2 R_TX_GPS.1
NetGPS_3: GPS.3 R_RX_GPS.1
NetR?#15_1: R?#15.1 R?#22.1 Sim800L.4(RXD)
NetR?#16_2: R?#16.2 Sim800L.5(TXD)

Not connected (* = marked no-connect by the designer): LoRa_Ra02 6(DIO1)* 7(DID2)* 8(DIO3)* 14(DIO5)* 15(DIO4)*; Sim800L 7(SPKN)* 8(SPKP)* 9(MICN)* 10(MICP)* 11(DTR)* 12(RING)*; U?#4 2(VCC)

### Notes on the sheet
- Communications
- SIM800L
- Protocol : UART
- ESP8266
- 0805 Packega
- (near R_RX_BLE) 0805 Packega
- SX 1278
- Protocol : SPI
- Communications Chip
- 1
- Arshia Madadi
- (in symbol Capacitor) +
- (in symbol Capacitor Electrical SMD) +
- (in symbol Component_1) RA-02
- (in symbol ESP8266 ESP-01) smartw.ir; ESP-01

### Library data of the parts
100uF 470uF = CAP_TANTAL_C: 6X3.2MM; Value: 3300u
ANT? = SIM20_ANT: ANT
BLE GPS = Header 4: Header, 4-Pin; LatestRevisionDate: 17-Jul-2002; LatestRevisionNote: Re-released for DXP Platform.; Publisher: Altium Limited
C?#21 = Capacitor: Electrolyte Capacitor
C?#22 = Capacitor Electrical SMD: DatasheetVersion: 2021; ComponentLink1Description: Website Smart World; ComponentLink1URL: https://www.smartw.ir/; ComponentLink2Description: Telegram; ComponentLink2URL: https://t.me/altium_smartw; ComponentLink3Description: Instagram; ComponentLink3URL: https://Instagram.com/smartgw.ir
C?#23 = CAP SMD_0603: 1.6 mm × 0.8 mm
C_SIM?#1 C_SIM?#2 = CAP SMD PACKAGE: as C?#17 on sheet POWER; Data: 2017-3-10; VALUE: 100nF
C_SIM?#3 C_SIM?#4 = CAP SMD PACKAGE: as C?#18 on sheet POWER; Data: 2017-3-10
D?#4 = Diode SMD Package: Diode SMD Pakage
JP? = Jumper: Company: E.P.I.L; Defualt State: Close; Design Date: 2011/11/02
LoRa_Ra02 = Component_1
R?#15-R?#22 = RES 0805 0.125W: RES 0805; Designer: Abbas Basereh; Desc.: RES SMD 0805; Data: 16-12-2016
R_RX_BLE R_RX_GPS R_TX_BLE R_TX_GPS = Res: Resistor; Published: 8-Jun-2000; LatestRevisionDate: 17-Jul-2002; LatestRevisionNote: Re-released for DXP Platform.; PackageReference: AXIAL-0.3; Publisher: Altium Limited
Rst_SIM = Switch PB: Push Button Switch
U?#4 = ESP8266 ESP-01: ESP8266 ESP-01 WiFi Module; ComponentLink1Description: Website Smart World; ComponentLink1URL: https://www.smartw.ir/; ComponentLink2Description: Telegram; ComponentLink2URL: https://t.me/altium_smartw; ComponentLink3Description: Instagram; ComponentLink3URL: https://Instagram.com/smartgw.ir; DatasheetVersion: 2021
Sim800L = SIM800L: Publisher: 3DFootprint.ir

## Sheet UI.SchDoc
size 420 x 297 mm; SheetNumber: 5; SheetTotal: 6
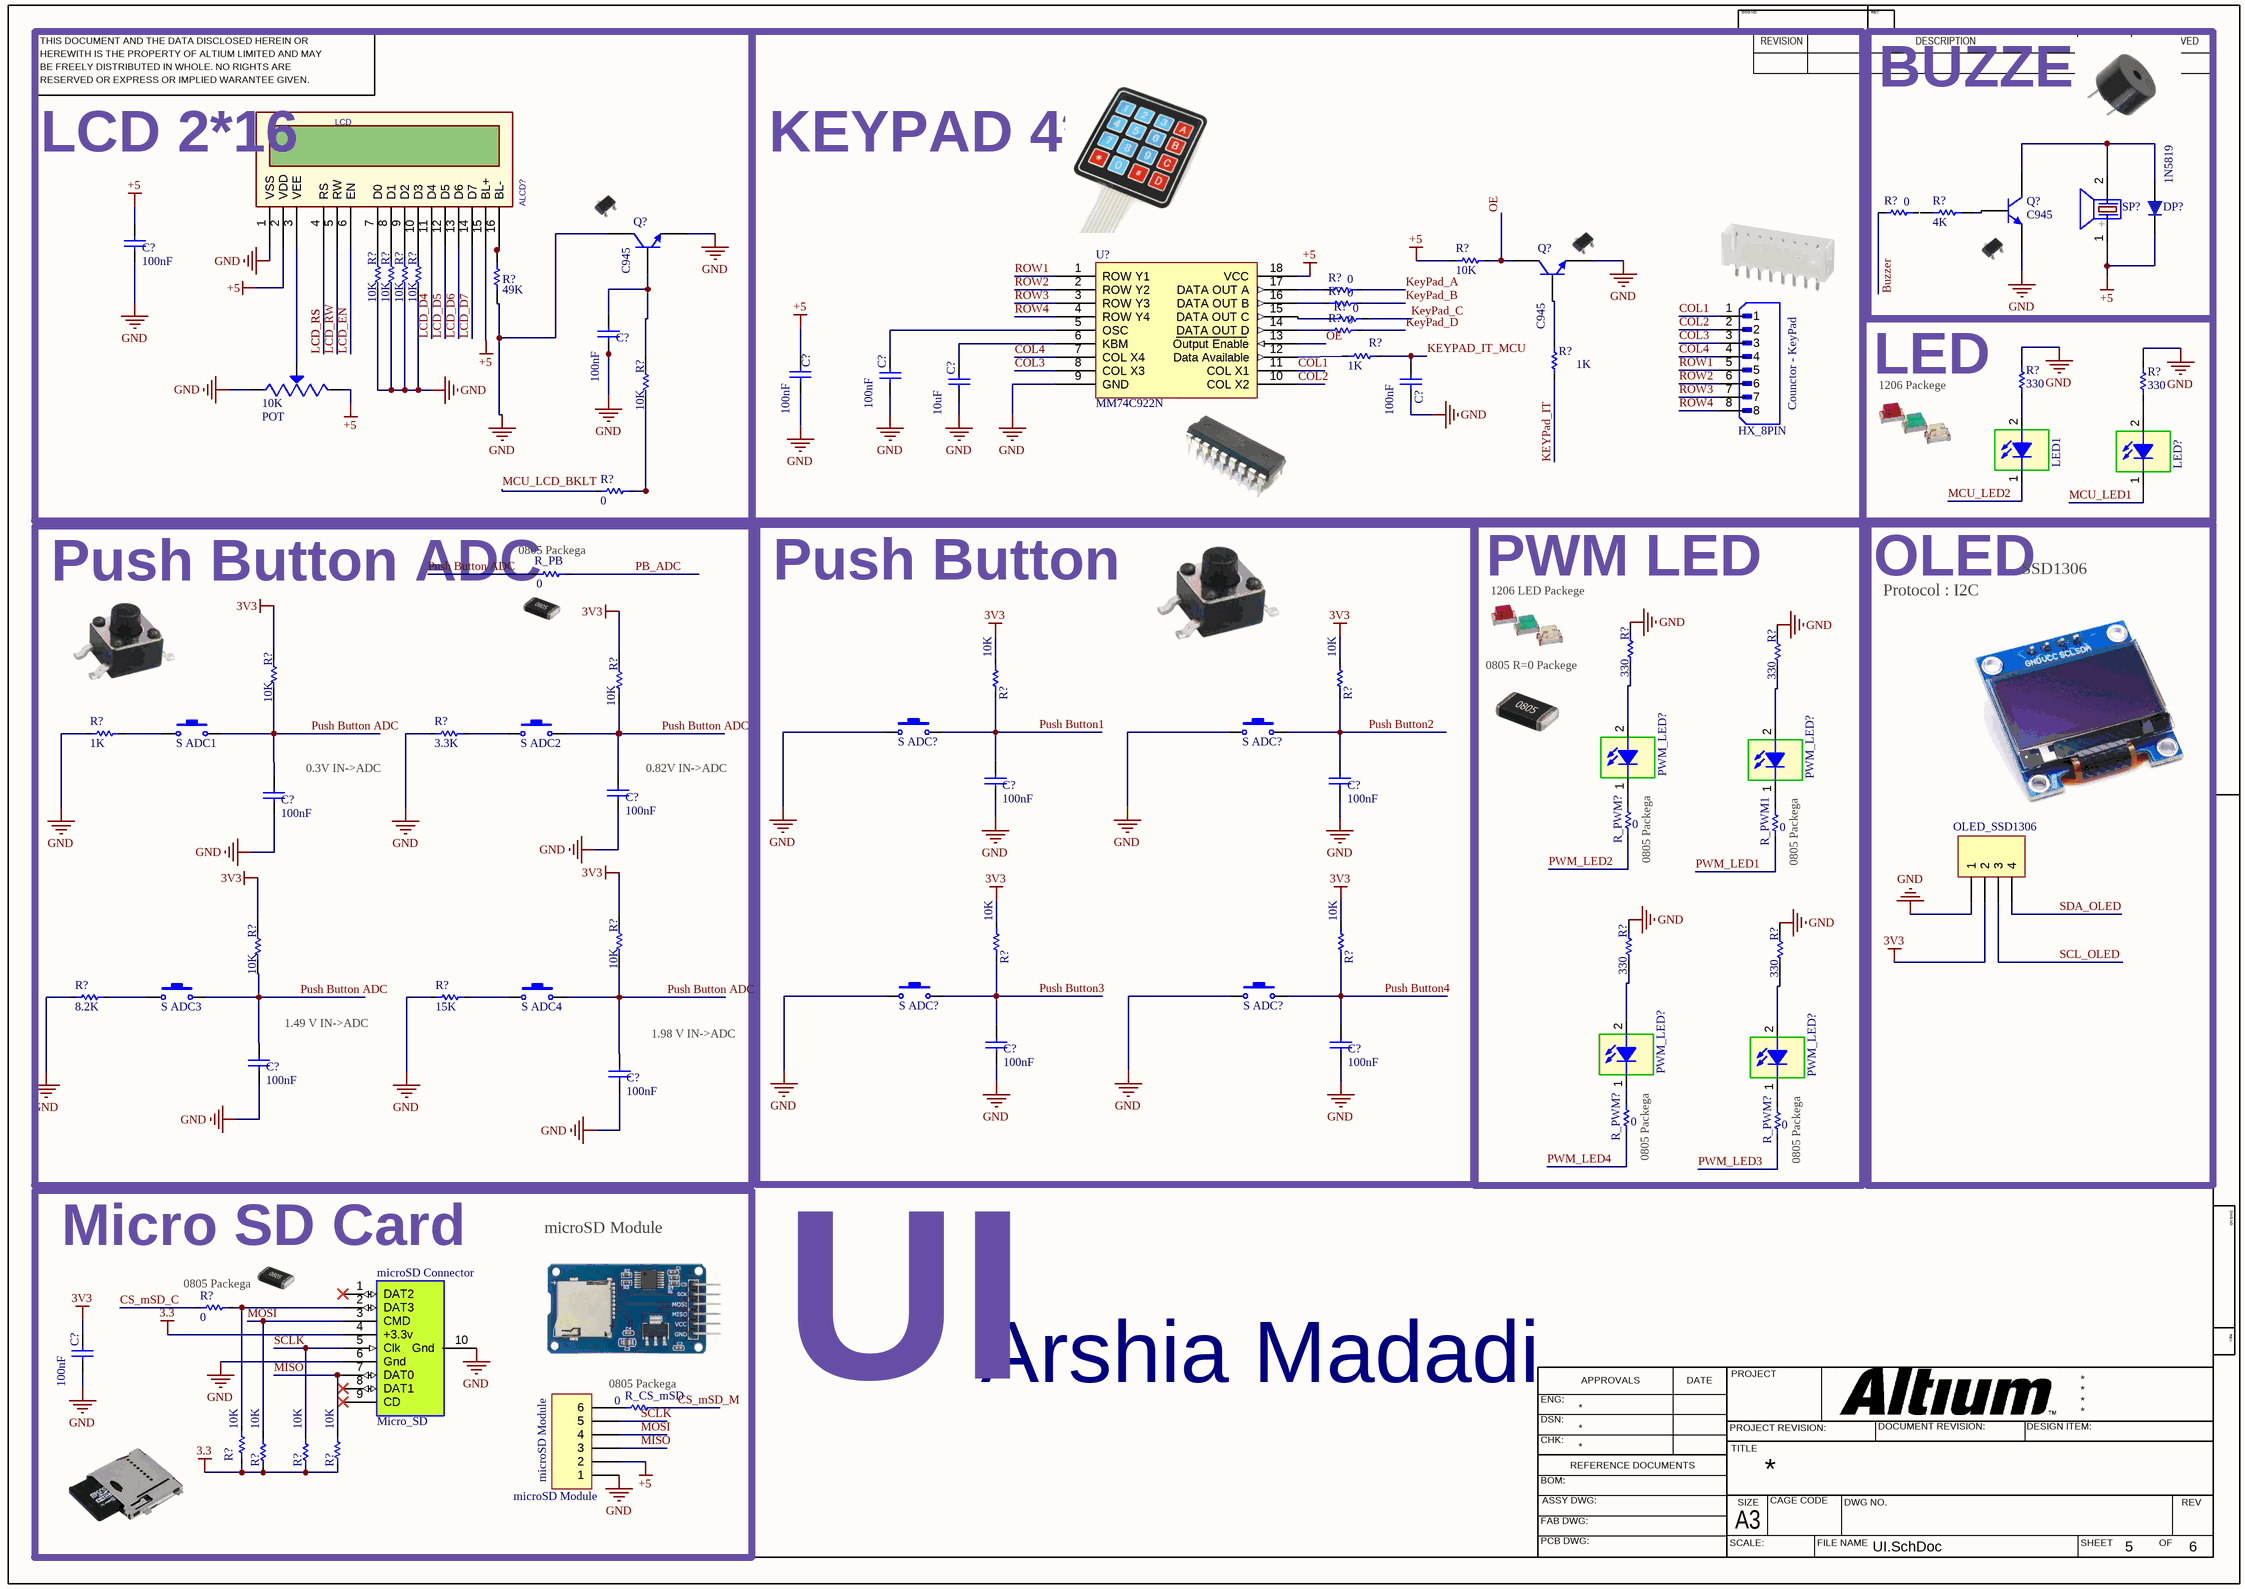
[diagram p4: UI.SchDoc]

### Parts
(Parts that share a designator on the sheet are numbered #1, #2 ... from top to bottom, then left to right.)
10K  POT  [TRIM_3296W1103LF]
ALCD?  LCD  [LCD_2X16 BLUE - 2.5mm]
C?#24  100nF  [MY_CAP_SMD_0603]
C?#25  100nF  [MY_CAP_SMD_0603]
C?#26  100nF  [CAPC3413X12N]
C?#27  100nF  [CAPC4817X12N]
C?#28  10uF  [CAPC4817X12N]
C?#29  100nF  [CAPC4817X12N]
C?#30  100nF  [MY_CAP_SMD_0603]
C?#31  100nF  [MY_CAP_SMD_0603]
C?#32  100nF  [MY_CAP_SMD_0603]
C?#33  100nF  [MY_CAP_SMD_0603]
C?#34  100nF  [MY_CAP_SMD_0603]
C?#35  100nF  [MY_CAP_SMD_0603]
C?#36  100nF  [MY_CAP_SMD_0603]
C?#37  100nF  [MY_CAP_SMD_0603]
C?#38  100nF  [CAPC4817X12N]
Counctor_-_KeyPad  HX_8PIN  [JST_B8B-XH-A(LF)(SN)]
DP?  1N5819  [430X270D]
LED1  SMD 1206 LED  [LED 1206]  (value not drawn)
LED?#1  SMD 1206 LED  [LED 1206]  (value not drawn)
microSD_Connector  Micro_SD  [MicroSd Connector]
microSD_Module  microSD Module  [HDR1X6-1]
OLED_SSD1306  Header 4  [My_1X04]  (value not drawn)
PWM_LED?#1  SMD 1206 LED  [LED 1206]  (value not drawn)
PWM_LED?#2  SMD 1206 LED  [LED 1206]  (value not drawn)
PWM_LED?#3  SMD 1206 LED  [LED 1206]  (value not drawn)
PWM_LED?#4  SMD 1206 LED  [LED 1206]  (value not drawn)
Q?#1  C945  [SOT23_M]
Q?#2  C945  [SOT23_M]
Q?#3  C945  [SOT23_M]
R?#23  4K  [RESC3413X04N]
R?#24  0  [0805]
R?#25  10K  [RESC3413X04N]
R?#26  10K  [RESC3413X04N]
R?#27  10K  [RESC3413X04N]
R?#28  10K  [RESC3413X04N]
R?#29  49K  [RESC3413X04N]
R?#30  10K  [1206_Res]
R?#31  0  [0805]
R?#32  0  [0805]
R?#33  0  [0805]
R?#34  1K  [1206_Res]
R?#35  0  [0805]
R?#36  330  [0805]
R?#37  330  [0805]
R?#38  1K  [1206_Res]
R?#39  10K  [RESC3413X04N]
R?#40  0  [0805]
R?#41  330  [RESC3413X04N]
R?#42  330  [RESC3413X04N]
R?#43  10K  [RESC3413X04N]
R?#44  10K  [RESC3413X04N]
R?#45  10K  [1206_Res]
R?#46  10K  [1206_Res]
R?#47  1K  [1206_Res]
R?#48  3.3K  [1206_Res]
R?#49  10K  [RESC3413X04N]
R?#50  10K  [RESC3413X04N]
R?#51  330  [RESC3413X04N]
R?#52  330  [RESC3413X04N]
R?#53  10K  [1206_Res]
R?#54  10K  [1206_Res]
R?#55  8.2K  [1206_Res]
R?#56  15K  [1206_Res]
R?#57  0  [0805]
R?#58  10K  [1206_Res]
R?#59  10K  [1206_Res]
R?#60  10K  [1206_Res]
R?#61  10K  [1206_Res]
R_CS_mSD  0  [0805]
R_PB  0  [0805]
R_PWM1  0  [0805]
R_PWM?#1  0  [0805]
R_PWM?#2  0  [0805]
R_PWM?#3  0  [0805]
S_ADC1  Switch PB  [SW-PB]  (value not drawn)
S_ADC2  Switch PB  [SW-PB]  (value not drawn)
S_ADC3  Switch PB  [SW-PB]  (value not drawn)
S_ADC4  Switch PB  [SW-PB]  (value not drawn)
S_ADC?#1  Switch PB  [SW-PB]  (value not drawn)
S_ADC?#2  Switch PB  [SW-PB]  (value not drawn)
S_ADC?#3  Switch PB  [SW-PB]  (value not drawn)
S_ADC?#4  Switch PB  [SW-PB]  (value not drawn)
SP?  (no value)  [BUZZER 7.62mm DC]
U?#5  MM74C922N  [DIP18]

### Blocks framed on the sheet
LCD 2*16: 10K ALCD? C?#24 C?#25 Q?#2 R?#25-R?#29 R?#39 R?#40
KEYPAD 4*4: C?#26-C?#29 Counctor_-_KeyPad Q?#3 R?#30-R?#35 R?#38 U?#5
BUZZER: DP? Q?#1 R?#23 R?#24 SP?
LED: LED1 LED?#1 R?#36 R?#37
Push Button ADC: C?#32 C?#33 C?#36 C?#37 R?#43 R?#44 R?#47-R?#50 R?#55 R?#56 R_PB S_ADC1-S_ADC4
Push Button: C?#30 C?#31 C?#34 C?#35 R?#45 R?#46 R?#53 R?#54 S_ADC?#1-S_ADC?#4
PWM LED: PWM_LED?#1-PWM_LED?#4 R?#41 R?#42 R?#51 R?#52 R_PWM1 R_PWM?#1-R_PWM?#3
OLED: OLED_SSD1306
Micro SD Card: C?#38 microSD_Connector microSD_Module R?#57-R?#61 R_CS_mSD

### Nets
3.3: microSD_Connector.4(+3.3v) R?#58.2 R?#59.2 R?#60.2 R?#61.2
3V3: C?#38.2 OLED_SSD1306.2 R?#43.1 R?#44.1 R?#45.2 R?#46.2 R?#49.1 R?#50.1 R?#53.2 R?#54.2
+5: 10K.3(CW) ALCD?.2(VDD) ALCD?.15(BL+) C?#24.1 C?#26.2 DP?.2 microSD_Module.2 R?#30.2 SP?.1(+) U?#5.18(VCC)
GND: 10K.1(CCW) ALCD?.1(VSS) C?#24.2 C?#25.2 C?#26.1 C?#27.1 C?#28.1 C?#29.1 C?#30.2 C?#31.2 C?#32.2 C?#33.2 C?#34.2 C?#35.2 C?#36.2 C?#37.2 C?#38.1 microSD_Connector.6(Gnd) microSD_Connector.10(Gnd) microSD_Module.1 OLED_SSD1306.1 Q?#1.2(E) Q?#2.2(E) Q?#2.3(C) Q?#3.2(E) R?#25.2 R?#26.2 R?#27.2 R?#28.2 R?#29.2 R?#36.1 R?#37.1 R?#41.1 R?#42.1 R?#47.1 R?#48.1 R?#51.1 R?#52.1 R?#55.1 R?#56.1 S_ADC?#1.1 S_ADC?#2.1 S_ADC?#3.1 S_ADC?#4.1 U?#5.9(GND)
Buzzer: R?#24.2 R_CS_mSD.1  [also labelled CS_mSD_M]
COL1: Counctor_-_KeyPad.1 U?#5.11(COL_X1)
COL2: Counctor_-_KeyPad.2 U?#5.10(COL_X2)
COL3: Counctor_-_KeyPad.3 U?#5.8(COL_X3)
COL4: Counctor_-_KeyPad.4 U?#5.7(COL_X4)
CS_mSD_C: R?#57.2
KeyPad_A: R?#31.1
KeyPad_B: R?#32.1
KeyPad_C: R?#33.1
KeyPad_D: R?#35.1
KEYPad_IT: R?#38.1
KEYPAD_IT_MCU: C?#29.2 R?#34.2
LCD_D4: ALCD?.11(D4)
LCD_D5: ALCD?.12(D5)
LCD_D6: ALCD?.13(D6) OLED_SSD1306.3  [also labelled SCL_OLED]
LCD_D7: ALCD?.14(D7) OLED_SSD1306.4  [also labelled SDA_OLED]
LCD_EN: ALCD?.5(RW) ALCD?.6(EN) microSD_Connector.7(DAT0) microSD_Module.3 R?#61.1  [also labelled LCD_RW, MISO]
LCD_RS: ALCD?.4(RS) microSD_Connector.5(Clk) microSD_Module.5 R?#60.1  [also labelled SCLK]
MCU_LCD_BKLT: R?#40.2
MCU_LED1: LED?#1.1
MCU_LED2: LED1.1
MOSI: microSD_Connector.3(CMD) microSD_Module.4 R?#59.1
OE: Q?#3.3(C) R?#30.1 U?#5.13(Output_Enable)
PB_ADC: R_PB.1  [project net PA0]
Push Button1: C?#30.1 R?#45.1 S_ADC?#1.2
Push Button2: C?#31.1 R?#46.1 S_ADC?#2.2
Push Button3: C?#34.1 R?#53.1 S_ADC?#3.2
Push Button4: C?#35.1 R?#54.1 S_ADC?#4.2
Push Button ADC: C?#32.1 C?#33.1 C?#36.1 C?#37.1 R?#43.2 R?#44.2 R?#49.2 R?#50.2 R_PB.2 S_ADC1.2 S_ADC2.2 S_ADC3.2 S_ADC4.2
PWM_LED1: R_PWM1.1  [project net PA6]
PWM_LED2: R_PWM?#1.1  [project net PA7]
PWM_LED3: R_PWM?#3.1  [project net PB0]
PWM_LED4: R_PWM?#2.1
ROW1: Counctor_-_KeyPad.5 U?#5.1(ROW_Y1)
ROW2: Counctor_-_KeyPad.6 U?#5.2(ROW_Y2)
ROW3: Counctor_-_KeyPad.7 U?#5.3(ROW_Y3)
ROW4: Counctor_-_KeyPad.8 U?#5.4(ROW_Y4)
Net10K_2: 10K.2(WIPER) ALCD?.3(VEE)
NetALCD?_7: ALCD?.7(D0) R?#25.1
NetALCD?_8: ALCD?.8(D1) R?#26.1
NetALCD?_9: ALCD?.9(D2) R?#27.1
NetALCD?_10: ALCD?.10(D3) R?#28.1
NetALCD?_16: ALCD?.16(BL-) R?#29.1
NetC?#25_1: C?#25.1 Q?#2.1(B) R?#39.1
NetC?#27_2: C?#27.2 U?#5.5(OSC)
NetC?#28_2: C?#28.2 U?#5.6(KBM)
NetDP?_1: DP?.1 Q?#1.3(C) SP?.2(-)
NetLED1_2: LED1.2 R?#36.2
NetLED?#1_2: LED?#1.2 R?#37.2
NetmicroSD_Connector_2: microSD_Connector.2(DAT3) R?#57.1 R?#58.1
NetmicroSD_Module_6: microSD_Module.6 R_CS_mSD.2
NetPWM_LED?#1_1: PWM_LED?#1.1 R_PWM?#1.2
NetPWM_LED?#1_2: PWM_LED?#1.2 R?#41.2
NetPWM_LED?#2_1: PWM_LED?#2.1 R_PWM1.2
NetPWM_LED?#2_2: PWM_LED?#2.2 R?#42.2
NetPWM_LED?#3_1: PWM_LED?#3.1 R_PWM?#2.2
NetPWM_LED?#3_2: PWM_LED?#3.2 R?#51.2
NetPWM_LED?#4_1: PWM_LED?#4.1 R_PWM?#3.2
NetPWM_LED?#4_2: PWM_LED?#4.2 R?#52.2
NetQ?#1_1: Q?#1.1(B) R?#23.1
NetQ?#3_1: Q?#3.1(B) R?#38.2
NetR?#31_2: R?#31.2 U?#5.17(DATA_OUT_A)
NetR?#32_2: R?#32.2 U?#5.16(DATA_OUT_B)
NetR?#33_2: R?#33.2 U?#5.15(DATA_OUT_C)
NetR?#34_1: R?#34.1 U?#5.12(Data_Available)
NetR?#35_2: R?#35.2 U?#5.14(DATA_OUT_D)
NetR?#39_2: R?#39.2 R?#40.1
NetR?#47_2: R?#47.2 S_ADC1.1
NetR?#48_2: R?#48.2 S_ADC2.1
NetR?#55_2: R?#55.2 S_ADC3.1
NetR?#56_2: R?#56.2 S_ADC4.1

Not connected (* = marked no-connect by the designer): microSD_Connector 1(DAT2)* 8(DAT1)* 9(CD)*; R?#23 2; R?#24 1

### Notes on the sheet
- 1206 Packege
- (near R_PB) 0805 Packega
- 1206 LED Packege
- Protocol : I2C
- SSD1306
- (near R?#41) 0805 R=0 Packege
- (near C?#32) 0.3V IN->ADC
- (near C?#33) 0.82V IN->ADC
- 0805 Packega
- (near C?#36) 1.49 V IN->ADC
- (near C?#37) 1.98 V IN->ADC
- microSD Module
- (near R?#57) 0805 Packega
- Arshia Madadi
- UI
- THIS DOCUMENT AND THE DATA DISCLOSED HEREIN OR
- HEREWITH IS THE PROPERTY OF ALTIUM LIMITED AND MAY
- DWG NO:
- REVISION
- REV:
- DESCRIPTION
- DATE
- APPROVED
- BE FREELY DISTRIBUTED IN WHOLE. NO RIGHTS ARE
- RESERVED OR EXPRESS OR IMPLIED WARANTEE GIVEN.
- ENG:
- APPROVALS
- PROJECT
- DSN:
- CHK:
- REFERENCE DOCUMENTS
- PROJECT REVISION:
- TITLE
- DOCUMENT REVISION:
- DESIGN ITEM:
- BOM:
- FAB DWG:
- PCB DWG:
- ASSY DWG:
- SCALE:
- A3
- SIZE
- CAGE CODE
- FILE NAME
- DWG NO.
- SHEET
- OF
- REV

### Library data of the parts
10K = 3296W1103LF: Trimmer, Potentiometer 10kohm 25turn Thd; MF: Bourns; Package: None; MP: 3296W1103LF; Check_prices: https://www.snapeda.com/parts/3296W1103LF/Bourns/view-part/2487625/?ref=eda; Availability: Unavailable; Price: None; Value: *; SnapEDA_Link: https://www.snapeda.com/parts/3296W1103LF/Bourns/view-part/2487625/?ref=snap
ALCD? = LCD: Alphanumic LCD; Designer: Abbas Basereh; Data: 16-12-2016
C?#24 C?#25 C?#30-C?#37 = CAP SMD_0603: 1.6 mm × 0.8 mm
C?#26 = CAP SMD 0805: CAP 0805; Designer: Abbas Basereh; Desc.: CAP SMD 0805; Data: 16-12-2016
C?#27-C?#29 C?#38 = CAP SMD 1206: CAP 1206; Designer: Abbas Basereh; Desc.: CAP SMD 1206; Data: 16-12-2016
Counctor_-_KeyPad = B8B-XH-A(LF)(SN): Connector Header Through Hole 8 position 0.098 (2.50mm); MF: JST Sales America Inc.; SnapEDA_Link: https://www.snapeda.com/parts/B8B-XH-A(LF)(SN)/JST+Sales+America+Inc./view-part/?ref=snap; Package: None; Value: *; MP: B8B-XH-A(LF)(SN); Check_prices: https://www.snapeda.com/parts/B8B-XH-A(LF)(SN)/JST+Sales+America+Inc./view-part/?ref=eda
DP? = 1N5819: Schottkey Rectifiers; Designer: Abbas Basereh; Data: 16-12-2016; Link: *; Part. No: *
LED1 LED?#1 PWM_LED?#1-PWM_LED?#4 = LED SMD 1206
microSD_Connector = Micro_SD: Micro sd in SD MODE 4pin
microSD_Module = Header 6: Header, 6-Pin; LatestRevisionDate: 17-Jul-2002; LatestRevisionNote: Re-released for DXP Platform.; Publisher: Altium Limited
OLED_SSD1306 = Header 4: Header, 4-Pin; LatestRevisionDate: 17-Jul-2002; LatestRevisionNote: Re-released for DXP Platform.; Publisher: Altium Limited
Q?#1-Q?#3 = C945: NPN Silicon Epitaxial Planar Transistor; Published: 2017-2-8; LatestRevisionDate: 2017; LatestRevisionNote: IPC-7351 Footprint Added.; DatasheetVersion: 2017; PackageVersion: 2017-2-8; PackageReference: SOT23; Publisher: Abbas Basereh; PackageDescription: 3-Pin SOT-23 Package 0.95 mm Pitch, 2.3 mm Lead Span; ComponentLink1Description: Manufacturer Link; ComponentLink1URL: http://www.taitroncomponents.com/; ComponentLink2Description: Datasheet; ComponentLink2URL: http://www.taitroncomponents.com/
R?#23 R?#25-R?#29 R?#39 R?#41-R?#44 R?#49-R?#52 = RES 0805 0.125W: as R?#15 on sheet Communications; Data: 16-12-2016
R?#24 R?#30-R?#38 R?#40 R?#45-R?#48 R?#53-R?#61 R_CS_mSD R_PB R_PWM1 R_PWM?#1-R_PWM?#3 = Res: Resistor; Published: 8-Jun-2000; LatestRevisionDate: 17-Jul-2002; LatestRevisionNote: Re-released for DXP Platform.; PackageReference: AXIAL-0.3; Publisher: Altium Limited
S_ADC1-S_ADC4 S_ADC?#1-S_ADC?#4 = Switch PB: Push Button Switch
SP? = PIEZO BUZZER: PIEZO BUZZER ACTIVE; Designer: Abbas Basereh; Comment_1: SPEAKER AND BEEP; Design Date: 1395/11/14; ComponentLink2Description: Reference; PackageDescription: THD; Publisher: Abbas Basereh; Mounting Technology: THD; Pin Count: 2; Status: Unreleased
U?#5 = MM74c922N_Fairchild: 16-Key Encoder

## Sheet ADC&Sensor&Relay.SchDoc
size A; SheetNumber: 6; SheetTotal: 6
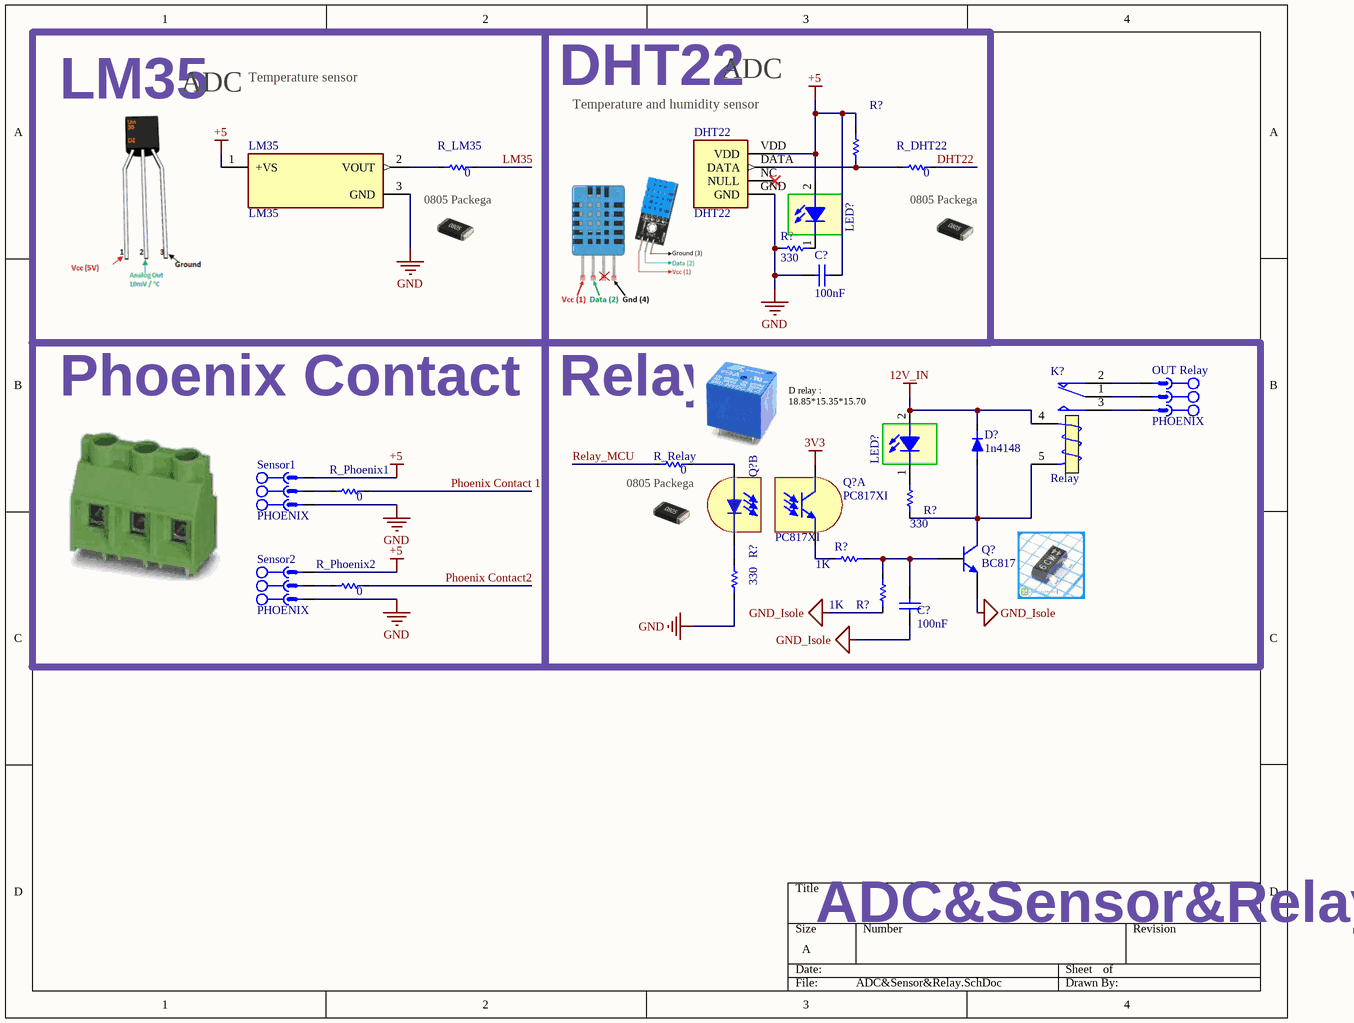
[diagram p5: ADC&Sensor&Relay.SchDoc]

### Parts
(Parts that share a designator on the sheet are numbered #1, #2 ... from top to bottom, then left to right.)
C?#39  100nF  [CAPC3413X12N]
C?#40  100nF  [MY_CAP_SMD_0603]
D?#5  1n4148  [SOD123]
DHT22  DHT22  [DHT22]
K?  Relay  [Relay 18.85x15.35x15.70]
LED?#2  SMD 1206 LED  [LED 1206]  (value not drawn)
LED?#3  SMD 1206 LED  [LED 1206]  (value not drawn)
LM35  LM35  [TO92127P521H735-3]
OUT_Relay  PHOENIX  [MSTB 2,5/3-G-5,08]
Q?#4  PC817XI  [SMT Gullwing Lead-Form]  (part B of 2)
Q?#5  PC817XI  [SMT Gullwing Lead-Form]  (part A of 2)
Q?#6  BC817  [SOT23_N]
R?#62  (no value)  [0805]
R?#63  330  [0805]
R?#64  330  [1206_Res]
R?#65  1K  [0805]
R?#66  1K  [0805]
R?#67  330  [1206_Res]
R_DHT22  0  [0805]
R_LM35  0  [0805]
R_Phoenix1  0  [0805]
R_Phoenix2  0  [0805]
R_Relay  0  [0805]
Sensor1  PHOENIX  [MSTB 2,5/3-G-5,08]
Sensor2  PHOENIX  [MSTB 2,5/3-G-5,08]

### Blocks framed on the sheet
LM35: LM35 R_LM35
DHT22: C?#39 DHT22 LED?#2 R?#62 R?#63 R_DHT22
Phoenix Contact: R_Phoenix1 R_Phoenix2 Sensor1 Sensor2
Relay: C?#40 D?#5 K? LED?#3 OUT_Relay Q?#4-Q?#6 R?#64-R?#67 R_Relay

### Nets
3V3: Q?#5.4(C)
12V_IN: D?#5.2(K) K?.4(T1) LED?#3.2
+5: C?#39.2 DHT22.VDD LED?#2.2 LM35.1(+VS) R?#62.2 Sensor1.3 Sensor2.3
GND: C?#39.1 DHT22.GND LM35.3(GND) R?#63.1 R?#67.1 Sensor1.1 Sensor2.1
GND_Isole: C?#40.2 Q?#6.2(E) R?#66.2
DHT22: R_DHT22.2
LM35: R_LM35.2
Phoenix Contact2: R_Phoenix2.2  [project net PA4]
Phoenix Contact 1: R_Phoenix1.2  [project net PA3]
Relay_MCU: R_Relay.1  [project net PB0]
NetC?#40_1: C?#40.1 Q?#6.1(B) R?#65.2 R?#66.1
NetD?#5_1: D?#5.1(A) K?.5(T2) Q?#6.3(C) R?#64.1
NetDHT22_DATA: DHT22.DATA R?#62.1 R_DHT22.1
NetK?_1: K?.1(COM) OUT_Relay.2
NetK?_2: K?.2(NC) OUT_Relay.1
NetK?_3: K?.3(NO) OUT_Relay.3
NetLED?#2_1: LED?#2.1 R?#63.2
NetLED?#3_1: LED?#3.1 R?#64.2
NetLM35_2: LM35.2(VOUT) R_LM35.1
NetQ?#4_1: Q?#4.1(A) R_Relay.2
NetQ?#4_2: Q?#4.2(K) R?#67.2
NetQ?#5_3: Q?#5.3(E) R?#65.1
NetR_Phoenix1_1: R_Phoenix1.1 Sensor1.2
NetR_Phoenix2_1: R_Phoenix2.1 Sensor2.2

Not connected (* = marked no-connect by the designer): DHT22 NC(NULL)*

### Notes on the sheet
- ADC
- Temperature sensor
- (near DHT22) Temperature and humidity sensor
- 0805 Packega
- (near R_DHT22) 0805 Packega
- (near LED?#3) D relay : 18.85*15.35*15.70
- (near R_Relay) 0805 Packega
- ADC&Sensor&Relay

### Library data of the parts
C?#39 = CAP SMD 0805: CAP 0805; Designer: Abbas Basereh; Desc.: CAP SMD 0805; Data: 16-12-2016
C?#40 = CAP SMD_0603: 1.6 mm × 0.8 mm
D?#5 = Diode
DHT22 = DHT22: Capacitive-type humidity and temperature module/sensor; MF: Aosong Electronics; SnapEDA_Link: https://www.snapeda.com/parts/DHT22/Aosong+Electronics/view-part/?ref=snap; Package: Package; Value: *; MP: DHT22; Check_prices: https://www.snapeda.com/parts/DHT22/Aosong+Electronics/view-part/?ref=eda
K? = Relay: SPDT Relay; Designer: Eng. Saeid Jorablo; Company: E.P.I.L; Design_Date: 2011/10/31
LED?#2 LED?#3 = LED SMD 1206
LM35 = LM35DZ/NOPB: Temperature Sensor Analog, Local 0Â°C ~ 100Â°C 10mV/Â°C TO-92-3; MP: LM35DZ; MF: Texas Instruments; Price: None; Availability: In Stock; Package: E-PKG AXIAL-LEADED-2 ON Semiconductor; Value: *; SnapEDA_Link: https://www.snapeda.com/parts/LM35DZ/Texas+Instruments/view-part/?ref=snap; Purchase-URL: https://pricing.snapeda.com/search/part/LM35DZ/?ref=eda; Check_prices: https://www.snapeda.com/parts/LM35DZ/Texas+Instruments/view-part/?ref=eda
OUT_Relay Sensor1 Sensor2 = CON_Phoenix_MSTB_03: 3 Pitch: 5.08 mm Color: green Contact surface: Tin Assembly; Manufacturer: PHOENIX CONTACT; Connector type: PCB Terminal Block; designer: ABBAS BASEREH; Max Current: 12 A; Positions: 3; Voltage: 320 V; Category: Connector; ComponentLink1Description: Header, Nominal current: 12 A Rated voltage (III/2): 320 V Number of positions: 3 Pitch: 5.08 mm Color: green Contact surface: Tin Assembly: Soldering  DESIGNER:ABBAS BASEREH; ComponentLink2Description: Reference; Mounting Technology: Through-Hole; Pin Count: 3; Revision 1: 2017-3-1; Status: Unreleased; PART.NO: PHOENIX
Q?#4 Q?#5 = PC817XI: DIP 4pin General Purpose  Photocoupler; Published: 2017-2-27; DatasheetVersion: 2017-2-27; PackageVersion: 2017-2-27; PackageReference: SMT Gullwing Lead-Form; Publisher: Abbas Basereh; PackageDescription: SOP, 4-Leads, Body 4/65x6/75mm, Pitch 2/54mm, IPC Medium Density designer:abbas basereh; ComponentLink1Description: Manufacturer Link; ComponentLink1URL: http://www.roboeq.ir/files/id/233/name/PC817.pdf/; ComponentLink2Description: DIP 4pin General Purpose
Q?#6 = BC817: 45 V, 500 mA NPN general-purpose transistors; Published: 2017-2-8; LatestRevisionDate: 2017; LatestRevisionNote: IPC-7351 Footprint Added.; DatasheetVersion: 2017; PackageVersion: 2017-2-8; PackageReference: SOT23; Publisher: Abbas Basereh; PackageDescription: 3-Pin SOT-23 Package 0.95 mm Pitch, 2.3 mm Lead Span; ComponentLink1Description: Manufacturer Link; ComponentLink1URL: http://www.nxp.com/; ComponentLink2Description: Datasheet; ComponentLink2URL: http://www.nxp.com/
R?#62-R?#67 R_DHT22 R_LM35 R_Phoenix1 R_Phoenix2 R_Relay = Res: Resistor; Published: 8-Jun-2000; LatestRevisionDate: 17-Jul-2002; LatestRevisionNote: Re-released for DXP Platform.; PackageReference: AXIAL-0.3; Publisher: Altium Limited

## Nets that join several sheets
3V3: MCU_F103VCT6 (17 pins), MCU_STM32F103C8T6 (18 pins), Communications (LoRa_Ra02.3), UI (10 pins), ADC&Sensor&Relay (Q?#5.4)
4.2V: MCU_F103VCT6 (P1.2 P1.17), Communications (9 pins)
12V_IN: POWER (DC_Power_Jack?.1 F?.1), ADC&Sensor&Relay (D?#5.2 K?.4 LED?#3.2)
+5: MCU_F103VCT6 (P1.3 P1.16 P2.2), MCU_STM32F103C8T6 (PA.2 PB.2), POWER (C?#19.1 L?#2.2 R?#13.2), Communications (BLE.4 GPS.4 R?#21.2), UI (10 pins), ADC&Sensor&Relay (7 pins)
GND: MCU_F103VCT6 (25 pins), MCU_STM32F103C8T6 (22 pins), POWER (12 pins), Communications (21 pins), UI (45 pins), ADC&Sensor&Relay (7 pins)
BOOT0: MCU_F103VCT6 (MCU.94 R?#4.2), MCU_STM32F103C8T6 (R?#7.1 U?#2.44)
Buzzer: MCU_F103VCT6 (MCU.77 MCU.90 P2.16), MCU_STM32F103C8T6 (PA.17 U?#2.29 U?#2.38), UI (R?#24.2 R_CS_mSD.1)
CS_LoRa: MCU_F103VCT6 (MCU.29), MCU_STM32F103C8T6 (U?#2.25), Communications (LoRa_Ra02.10)
DHT22: MCU_F103VCT6 (MCU.25 P1.21), MCU_STM32F103C8T6 (PA.5 U?#2.12), ADC&Sensor&Relay (R_DHT22.2)
DIO0_LoRa: MCU_F103VCT6 (MCU.81), MCU_STM32F103C8T6 (U?#2.33), Communications (LoRa_Ra02.5)
GPS_RX: MCU_F103VCT6 (MCU.80), MCU_STM32F103C8T6 (PB.14 U?#2.21), Communications (R_RX_GPS.2)
GPS_TX: MCU_F103VCT6 (MCU.83), MCU_STM32F103C8T6 (PB.15 U?#2.22), Communications (R_TX_GPS.2)
LCD_D4: MCU_F103VCT6 (MCU.41), MCU_STM32F103C8T6 (PB.8 U?#2.42), UI (ALCD?.11)
LCD_D5: MCU_F103VCT6 (MCU.40), MCU_STM32F103C8T6 (PB.9 U?#2.43), UI (ALCD?.12)
LCD_D6: MCU_F103VCT6 (MCU.39 MCU.47 MCU.95 P2.6), MCU_STM32F103C8T6 (PB.10 U?#2.45), UI (ALCD?.13 OLED_SSD1306.3)
LCD_D7: MCU_F103VCT6 (MCU.38 MCU.48 MCU.96 P2.5), MCU_STM32F103C8T6 (PB.11 U?#2.46), UI (ALCD?.14 OLED_SSD1306.4)
LCD_EN: MCU_F103VCT6 (5 pins), MCU_STM32F103C8T6 (PB.6 PB.7 U?#2.40 U?#2.41), UI (5 pins)
LCD_RS: MCU_F103VCT6 (MCU.54 MCU.55), MCU_STM32F103C8T6 (PB.5 U?#2.39), UI (ALCD?.4 microSD_Connector.5 microSD_Module.5 R?#60.1)
LM35: MCU_F103VCT6 (MCU.24 P1.20), MCU_STM32F103C8T6 (PA.4 U?#2.11), ADC&Sensor&Relay (R_LM35.2)
MCU_LCD_BKLT: MCU_F103VCT6 (MCU.71), UI (R?#40.2)
MISO_LoRa: MCU_F103VCT6 (MCU.31), MCU_STM32F103C8T6 (U?#2.27), Communications (LoRa_Ra02.12)
MOSI: MCU_F103VCT6 (MCU.52), UI (microSD_Connector.3 microSD_Module.4 R?#59.1)
MOSI_LoRa: MCU_F103VCT6 (MCU.32), MCU_STM32F103C8T6 (U?#2.28), Communications (LoRa_Ra02.11)
NRST: MCU_F103VCT6 (5 pins), MCU_STM32F103C8T6 (5 pins)
OSC32_IN: MCU_F103VCT6 (C?#12.2 MCU.8 Y?#2.4), MCU_STM32F103C8T6 (C_Crystal1.2 U?#2.3 Y.4)
OSC32_OUT: MCU_F103VCT6 (C?#14.2 MCU.9 Y?#2.1), MCU_STM32F103C8T6 (C_Crystal2.2 U?#2.4 Y.1)
OSC_IN: MCU_F103VCT6 (MCU.12 R?#2.1), MCU_STM32F103C8T6 (C_Oscillator1.2 U?#2.5 Y?#3.2)
OSC_OUT: MCU_F103VCT6 (MCU.13 R?#3.1), MCU_STM32F103C8T6 (C_Oscillator2.2 U?#2.6 Y?#3.1)
PA0: MCU_F103VCT6 (MCU.23 P1.14 P1.19), MCU_STM32F103C8T6 (PA.3 U?#2.10), UI (R_PB.1)
PA3: MCU_F103VCT6 (MCU.26 P1.22), MCU_STM32F103C8T6 (PA.6 U?#2.13), ADC&Sensor&Relay (R_Phoenix1.2)
PA4: MCU_F103VCT6 (MCU.18 P1.13), MCU_STM32F103C8T6 (PA.7 U?#2.14), ADC&Sensor&Relay (R_Phoenix2.2)
PA6: MCU_F103VCT6 (MCU.65 P2.22), MCU_STM32F103C8T6 (PA.9 U?#2.16), UI (R_PWM1.1)
PA7: MCU_F103VCT6 (MCU.66 P2.21), MCU_STM32F103C8T6 (PA.10 U?#2.17), UI (R_PWM?#1.1)
PA9: MCU_F103VCT6 (MCU.68 MCU.93 P2.19), MCU_STM32F103C8T6 (PA.13 U?#2.30), Communications (R?#15.2)
PA10: MCU_F103VCT6 (MCU.69 MCU.92 P2.18), MCU_STM32F103C8T6 (PA.14 U?#2.31), Communications (R?#16.1)
PB0: MCU_F103VCT6 (MCU.35 MCU.67 P1.25 P2.20), MCU_STM32F103C8T6 (PB.4 U?#2.18), UI (R_PWM?#3.1), ADC&Sensor&Relay (R_Relay.1)
PWM_LED4: MCU_F103VCT6 (MCU.36 P1.26), MCU_STM32F103C8T6 (U?#2.19), UI (R_PWM?#2.1)
RST_LoRa: MCU_F103VCT6 (MCU.37), MCU_STM32F103C8T6 (U?#2.32), Communications (LoRa_Ra02.4)
SCK_LoRa: MCU_F103VCT6 (MCU.30), MCU_STM32F103C8T6 (U?#2.26), Communications (LoRa_Ra02.13)
SWCLK: MCU_F103VCT6 (MCU.76 Program#1.5), MCU_STM32F103C8T6 (PROGRAM#2.2 R?#6.1 U?#2.37)
SWDIO: MCU_F103VCT6 (MCU.72 Program#1.4), MCU_STM32F103C8T6 (PROGRAM#2.3 R?#5.1 U?#2.34)